# Altium project ai_uwb_smart_flashlight.PrjPcb (part 5 of 6)
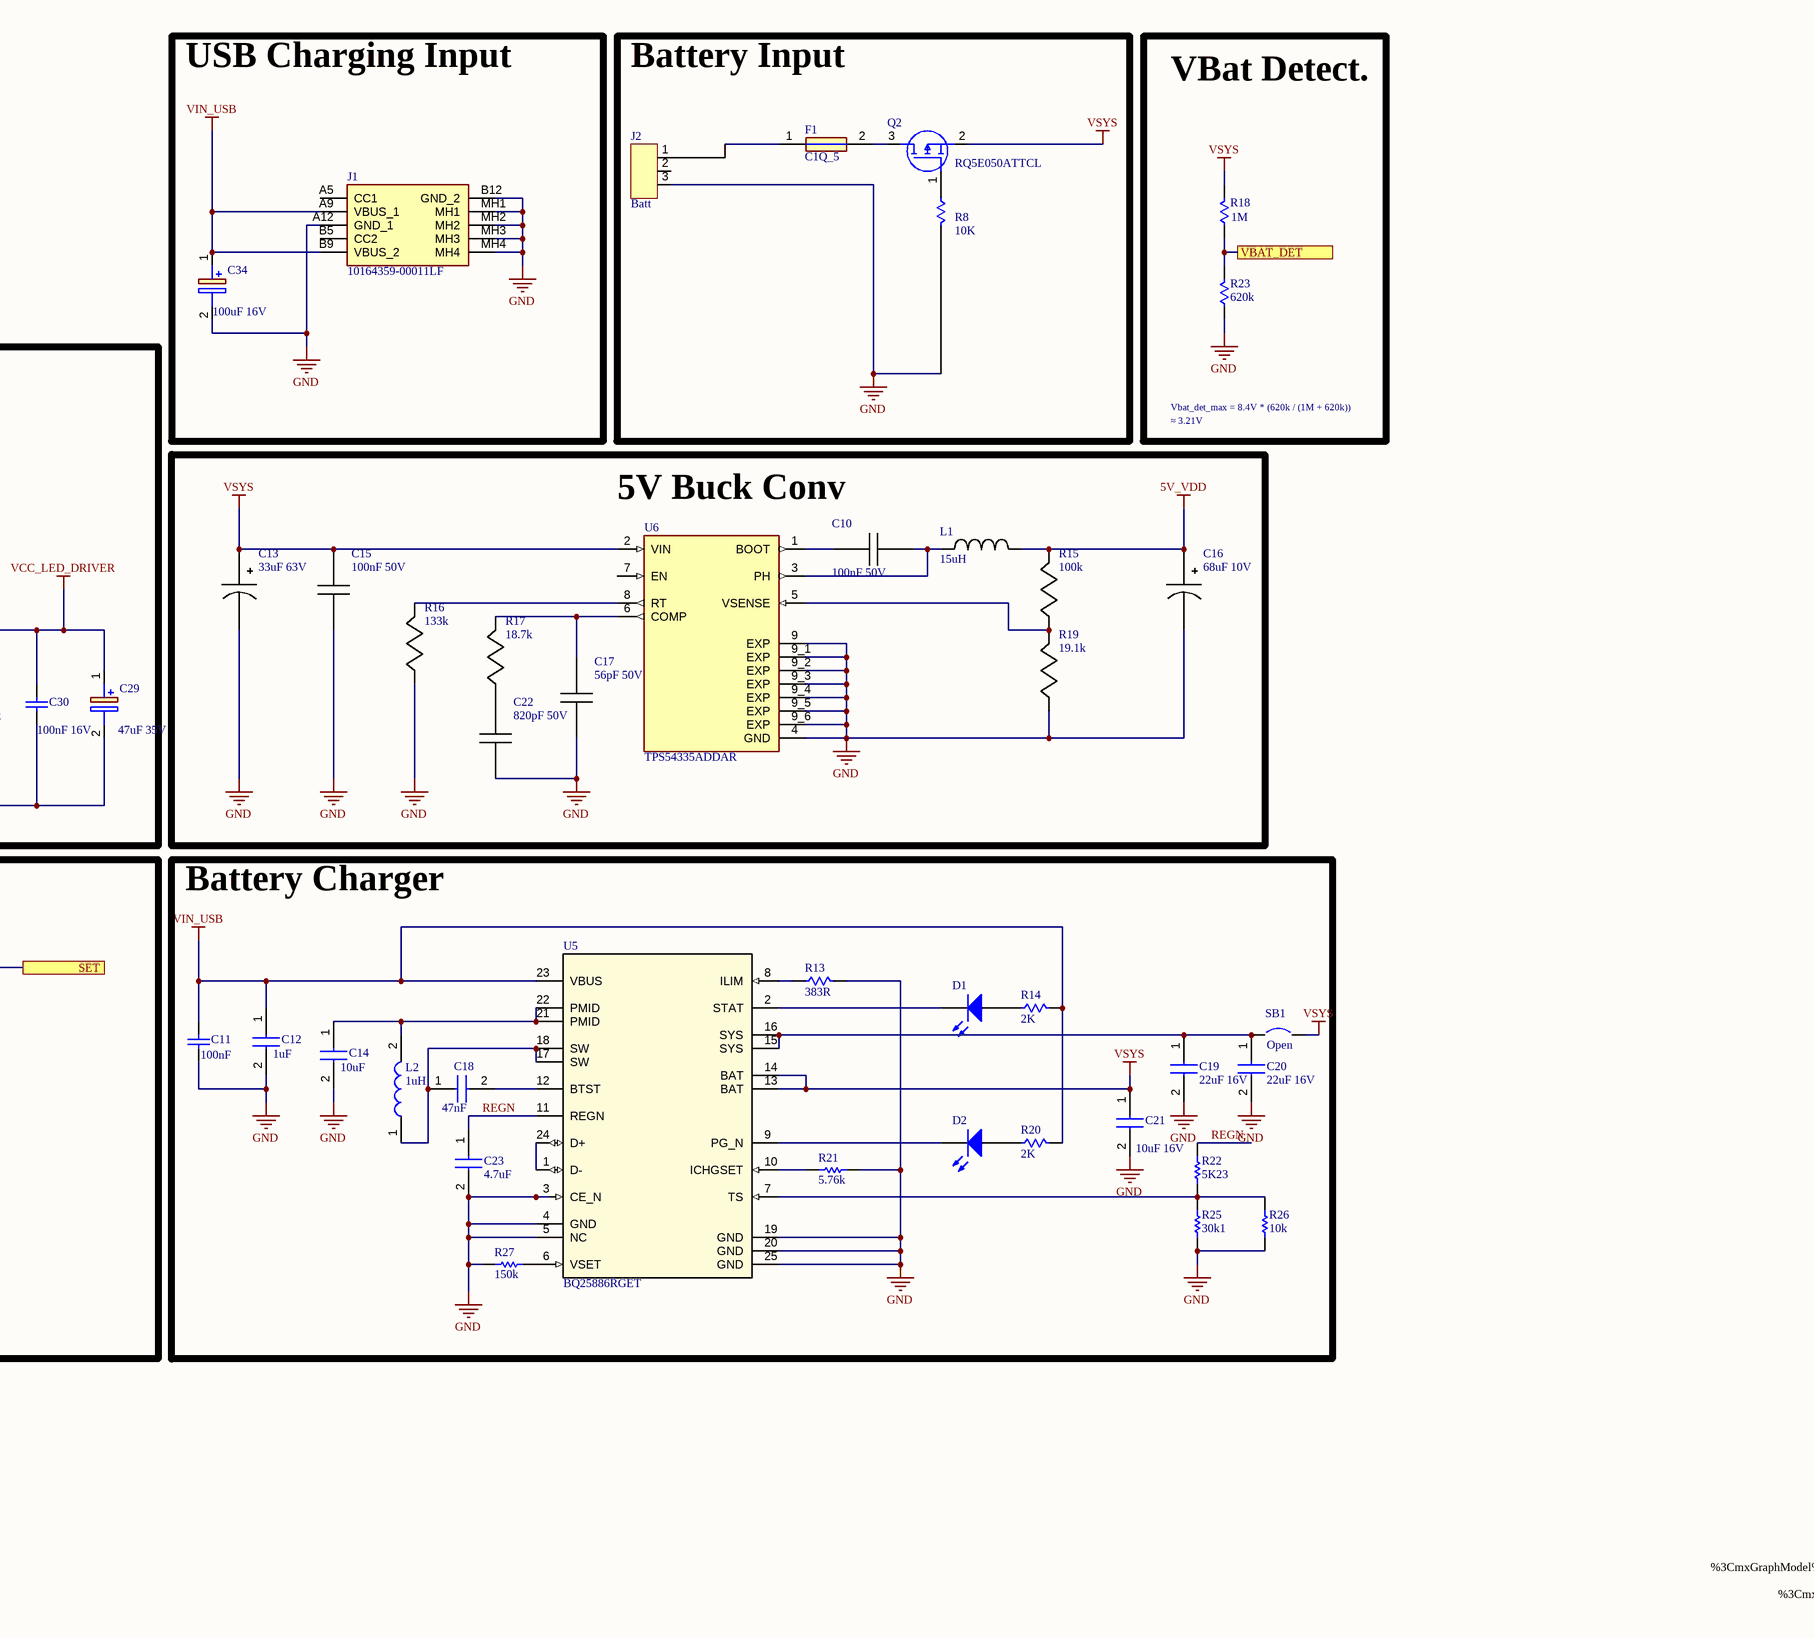
[diagram p7: Power supply.SchDoc, right]

## Sheet Power supply.SchDoc (continued)

### Notes on the sheet (continued)
ZUIVqCa8Jv7V0tcZ495%2Fp7y8vKKiorq6mtSt4F0Mijc1NTU0NFRUVGjbxaCpKzCuCMSDr6CGoQU5luogRLBwSV9XOmo5DOvgTSQOWdLSXD%2BWgBAWL5Y%2BDjo6I0uXBwcH79%2B73XoigI1ZVqQ%2FVo%2B%2FqqUcAB0wbgRzczBzDRPWoOIGIh%2B48M8%2BS5fL5cFB6lU68NqCMQI2W%2BH7gs1mq5Us4vl%2Fl3EEOQRBoN6GJtLU1FRTU1NaWlpSUvJp%2Bk4DtonC%2Bpdy%2B%2Byzz34dZpiYIVqAAZ1nWv3Pf%2F4zPJrIOq0B3xMDntrLXVBeXi6VSjVBHLzTgV5Gqy4mMjwEjXwx0RGR4SHpqUm4CojBQUfI5zKsY8CnUcjnTjc3fsHc%2BPJTZeRLp9dNPOhQUQ4OOkI%2BF1eod3fjgQgHjKf7iVzv3u0H0Q7%2BhKttW7DL9YK5cXXBgstnN4Ja0u9Scqz28iHxo%2B1%2FqaysPHnyJN7JaBJvbGysrKwsLi5eFaLpCjKaaujwE0y4w2jyzBjD7BiiBRjQeabVb968CY%2FmJLHSocMLppdDdu746MSJE5p0KGrzNDQ0lJeXh64N0ktlYIDJ3zu%2F%2FKAnhLFIdPxErjDFoG3dfkOsYzXTRGFicarRZAs6z7%2FYWJuy2ezojYIr52IunV4XH2M%2FYihZw6kfbW%2B02vw0lAOgg%2Bat5HI5KOUgykEcv3iRd1tbG6xRoAedJ5QzzbilYtHt3rrBwcFbPWWR62xHdfiqtvK%2F0UQvD0FlZeWpU6fUdjKaJNbW1mZn7zXI5aMl5RKJ5JkxhtkxRAswoENu9e3btwPrTCpPOhP5ri5a6FhdXa1JP0KTp6mp6eDB%2FXqpNowxeFEmUzi6fdoK7Mx8l7jILrQfP15ka2OqupwKP4tqfPKzjo21KbLNw%2BGwJ1sAo0G6AYrJFA6bzbazMYN5nInRRodngJ5ykI4OsggFthJAlgOU4ydyHRoaCg0NtbE2zdqTIZfLcQd5pCcNKIfDYb%2B%2B2kZG%2BN7qKUOgw2KxSJl%2Fx7uf7PzrWCgHeqe6uro3ItZMcCuhJeUCgYA8wDD7hmgBBnTIrX7z5k1kP9DgmjdKR31za58uSm%2BVLio76PlhrL22a5W1es%2Fz8w%2FTEIzmPzU1NW2JflOrU6tmjgwPycvLzsrKKsjPRSE7e19u7j5wbIkfkrUnA%2BUhReADGpa6AMgi0Z3FdGO8EPr4ZGYdG2tTIAltAY7%2BkvX4q421qbGRAr90YB1jYzZLKdSJ3ihgsxWF6LFiNEWNSjlo6srdjdfSXC%2BXy2HpJVLTHh5%2BFLbh9b6%2BPjyF6oyIcgR2ZmAgByzcFCltJNIY%2BqIq8DeavmK5t7bz5lRdU0VFued8jVZg6aut0JLykydPkgcYZt8QLcCAjppWH3Wpub7eB5pykGPFa53Jt3rK%2Bm6duXun83Zv3fdX9oHhvvy988cDd8LWh1D1FzqkV1efWLLIieYyR%2F2ppbm%2Br6%2BvpqYG136tq6utqanJzt6HW7KGYQbPhuIwmwCz5k4O03btcIFgbaVYz8JisbQaPyYn6yDKwdtk1Oad%2BAwCOzMdWEex8o7NluR43Oopu9VTBgorOk%2BEaX7VmlAOuFZF01UF%2BbmR4SFg4BuewJqaGnt7%2BxUBi9ADSWUwAqccqKS%2FyDJ%2FrztYgn6u5tOLiwt16HCoDvk84xPNb%2FoYczJLytWMqYZOYkBH%2FR0A%2B4EsFkuHT88xvidCPhcsxYHIWm397t7pvHphW6t0EW6bf%2BznFfK5%2Bo4%2BIO4AACAASURBVPqKQj3Orl2f0lQsJjoia09G1p4MJMmH3aw9GSCDGfF%2BVVhYOOIZqk6yAAWnOdMUy%2FufOvpG5edkzEV5UCQx1n54%2BFFMdAQsgkCeQTsIERw40jGlpaV9uevTrD0Z6alJqDQhn4srSuPpk411NKQcUmsnJsSg1iYpgOPpcOF%2BIldIRBoneINoFdeBdcB9%2FeWzb8LrAJaRtRLFaVVDyKwh5dCXrLm9HJjvUKUZVfqhP%2BPv4NfIiNWoA9FLpKmp6RXfCfLAhcQ5N2%2FeVNt7M4kT3wIM6Khvc7TUXDddEJ37mrlO5q3SRZfPvnn%2F3m31NcNSb%2FfW6dc5wBefp9J3KwRBSKXS0tJSiURSXFxcWlpaXl5Of0hzczNVFwPryZF9kcjwENyC842ebj%2BRKwIdAJTOpjXfXf3uu6vfXTx%2F6u%2BlH6mGC%2Bc7L5zv%2FPu5MwhodiY4AOhM5RrZzjJtrgyWFq6XFq4%2FWx0AtwmvBr5kBhyDDw8%2FUns3Jw%2FraEg5%2BGXill3QfArymYXnhAZBJhwhM0gv1DaLhonaso6itdns4jyFwsqtnjKFdzk2e1wlOmOknMSEmPTUpKSkhPj4%2BI%2F%2F9mF6ahIpILJHLQaCLpJA7jmkHCGfO2qXUldXV15eXlRUJFFu5eXldXV19EflZH%2BNmnr8IhbTnywpz87OxrpqJmrgFmBAh%2FIGIK3kiVxqXnbQE322UtYM%2BwFYR9Wvgg5vspc7n76nkEqlRcoNOhcULygooF%2BilbX3S7X1gYUqfiJXsDUCFnSAb8AqXWJCjI6g035WFXRg6PpbYhhYWK4pfg1qBeP6%2B1uj7e3tYVGMuxsPKAcWyKitvIZrzk2mcMY7gF4OaYBUrTNq7cjwkOHhRwX5ue5uPD%2BRq5%2FIFazbIVENNEhMdISfyBXQE1RPIAX34KZ6Fs1TtGIdsIxsbm4cvZEfvZHPYrONjcdRR2eMlAOLzLuot6GhIbAU5SdyTUyISUyI2fbBFi8vL2srE5AjAgYB5QQEBCRsU%2BTRvG1%2F0zk%2Fz%2FiEpiMiCKKkpAS6INQRFRcXHzt2TCKRkCyaksoJWx8y3i0Dmn%2BMDjI2Rk2KKAM6lLcB10qeGO3OD2PtR3xcU1aI4odbPWWt0kX0lsg1eb0%2FTU8h9Qtot6mp6fjx48XKTbWLKSkpKSwsLC4uRvlJkaamptB1apaaDw8%2FAjNrsEoFjK0NDz%2BqkhbDApbI8BAdQUedREcxshqzQ159FUAn4f1XoFlgXI8MD7GaaZKVlQUKPUjOMTz8SFXrGbUnvVzHfKqRmaligdi4BhfHaSnxDh%2FG2pOcbEzlGuGrroaGhrq7r0LKjBkz0E%2FAdoWFhShl8%2BbNaFlQQX6uXC4HBm1vP1dUJBkaGhoefoQyq0bmzLF%2F5%2B3N77y9ecECL%2FQrWLKODA%2FBl1VrzjpIv2p%2Fptv%2BTDenOdM4HPY4vZVjpxwAHS8vLzbFVlNTA6CDO6IfGhoK3xACT2NLcz1QTmFhIXoU0cuCHr%2FfX8TLnU8ze15bW1tUVJSfn19cXCyRSAoKCiQSSVFRUXFxcYlyy8%2FPp2GdsrLj49piaEk5o4NMMVgZLJkBHbqmR1rJE%2BNwQEaIwGYGXZ1Ufrt%2F7%2Fbls2%2FuTHAYyzscsMyTpoOoqKg4duxYSUkJkhUD7kD%2FUqrcJBIJjV2vwsJjqtXDQQd%2Bxft9uVyuOnXV0bha56krIZ9rMoWDQMfF1RVuKwwtnR3tILeQy%2BX46CKXy%2BkHGBrWUb1kvacgpXUZIWqVLkL66WamHBaLNZX7qymdoaGhrq4ukmUdoJzysmI8HUAHbxC4EWjEHRoawvPj8ZDgFXi2kOAV8GtoaCjYyiNRo4aso4APNru6wPvnu9fu3ulsqfBhjY9lZL1QjskUjlwu9%2FLyWrNyFviswP%2By2WwS6IhDlmx4PRieNGi9lub6qVwje3t7SBSHLAEZ59gnDfX%2BBOq3wMwv0kmfSWiXIIji4uK8vDyYOi9UbjCHXlJSUlpaely5FRUVoUNIkaampqhNG%2FRbYVQa9AOMWyuVAWpSJDCgM8ptmDCt5NgowcWmoFFqQ%2FFz360zrdJF6JXTIZK9by%2BpU0C7dXV18PFUUlJSXFyMWAc%2BpFD%2FUlZWduzYMXQUKVJbW%2FvnLX8iVQwHnYL8XAQcsIxFLperTl2NEXRwiY6LqyugAJwXDc%2Bv%2FWElWocFvuhJ1VbdNSDryAjRpdNr79%2B7DZOY4OccKIekwkJq7ZjoCJiWwr1twKWRGgQ0squkxUI%2B19bGtKuri0pvScjnAqrGREfAdCQ4L0PusdLT01RbTxPWUdg%2FVFhGRsrIb7LYbL0rI%2BuLclgsFoDO%2BjWCksN%2FLj3yLgrSY1Ek0IHGtLYyGZHo3OjpBrkmgI6l5QyYPAUPEnK5HE0vqjbj7yDl9XVBNBa8ysrK9u%2FfX1lZCV9ZOOhAL1Su3MrKyiorK0n9D9o9dOjAYp8xrQOlamfk1orxUk4xTBkymQGdUVofaSVrYqAsNkogI0QyQpS%2Fd7440JrqlVCbXnbQ8%2Fsr%2B0apDcXP9%2B%2FdlhEibc%2BIqrFubWBJSQnqC0iRioqKnJycEydOkEAHlJGPHz9eVlYGXrFKS0urqqpIh8MuQRD79%2BeQuhgYaDs72mGiqiA%2FF%2FQ%2FUIrq1JXOoBP9djishvBfvjw97W%2FpaX8D0GGxWO%2B8rZipiQx%2FMmtwo6cbFoiaTzXSEHTo9XVQO%2Bs9MtfJXEaIrl7YBs8FPHhqKUfI50Jr3%2BjphtbGvaiSKgag4%2BXlBaId8MgNogXZhXa5XA74QjoKdm%2F0dCMMglkqRDmff57u5eWlVjg6KusoFK7Z7F07XK6c23KtMzklwYGlb8vIeqQcG2tTAJ2AZQslR3LwcDj3K1XQKcjPLS8rQorwEJnKNTI2YuMyzv%2F3f%2F%2F13dn1rdLFsVEvqW18msQPY1%2BWEb4ywjd%2FrzsS%2B9Hkx3%2Ba62SemeIiI3xbpYuzM8Zx7VJOTlZtbS1VB5Kfnw9T5Ohzq7CwsKioqKSk5Pjx49AFVSo3GqFOWVnZjpS%2F4ldHExcHWpcd9IIL%2FzD2ZZqcaNKK0UGmGKMMnMyAzug3AGkl01tbAQ0b%2BMImzSPQvCHoJxkhununc%2FTaUOS4cm6LzrNXhYWFVIunmpqaCpTb8ePHYYoK9TLFxcXQv1RWVkqVW2VlZWlpqdp%2BqrGx8ciRIztSPkLXC3o5MPqCFoiQzxWHLIFhGMQ5Qj6XrKNzasU%2Fzn2c%2BOHbEWGvif3d3%2FiD95%2FWLUCh9qhYdvqvitDyAUkZOTQ0lMViebi9gNJtbcxAchMQEADTZCBJgnEaWCcrK4tmUMevxVCsU3bQs7MpqOfS51fObZERIm%2F36SwWiyTLgXq6u%2FFQa7c017u78W70dKtVcQVF7EULnYECoUHQvF5XV5fa8uEsOOhAChKVyeXyoaEhnVlHAXBstreHhbeHxQj06Hc5pH4pB%2BnoODrMFj%2B7BQcH74h3rKmpKS8rQgIwaKK%2Bvj6wUIpAB6auOjvaN4Z7991QaI%2F9cOVT4BWtWCc7ww2OunR6HQzbWrFOrWShjPC92LQSoRLpydfLbujawOLiYqoJ9JMnT%2Bbk5FRWVsLnFuqFioqKSktLKyoqpFJpVVXViRMnqqqqysrKqDyAVlVVHTlyZLGP46h19vG0gOtFF07FOowdZIpBaRIlM6Az%2Bs3AtZJpbCWDLOfnu9cGBwdvdh%2BVESKYRxj1jRLyufBprsmScqrqXutM1vx0eJX%2B%2BlH8sWPHysrK1AJKQ0PD4cOHy8vLy55uQDxAOZWVldC5nHi60UiGDiu3ZX7u%2BNlHjbc019fU1Hh5ee38KASFgOWLvLy87O3tSeqoiXFBKA%2BKRL25DKzv29qY%2Bnha4KAD5ApMoyppQHKdUSuJMqA5LBtrU4Gd2QSEV5bMLM3zaKnwkeR40FAOqqFWEWMjMk9An64h6OATWGhtXW5uNswYqtaEXq4jsDOzmG5sZqpYxabfhZAaUo44ZAkEXJ8apZDs5YBEB0AnLy%2BvsbFRIpGIxeLg4OA6yULA96lcIxDYuLvxgO%2Bj3w4HBxE3errDNryOpq5%2BuvPN%2F%2Fnv%2B3K5%2FJdffum7dUZG%2BNZJFqo2IFUKDNjQvSi7Jl%2BqMVu1BKUSmO%2BV9hjwG3%2F57EYZ4asVJ6mWqTYFVnFSgU55eXleXl51dTX64gKVweLi4srKyhMnTlRXV59UbidOnJBKpVSrzU%2BcOHH48OHkj58xl6W2PiDEAmNmd%2B90AiCqzYkM5zA6yFTDk8HTGdDR6BYgrWSq70ggFaRDMHD3GswjqH0xVBOVXw8ig4DOF198SgM6IIk5fvx4xdMN5Dc1NTV1dXU1NTXQuVQrN5jeUgtMzc3Nh5RbcNBi1cunSYFVP7hUAMVJOsKg3IB%2BJUXCNyhWlvp4WizwsDBXKnyw2GwkotMj69hYm6o6msCdToxrHNYn4%2B0JOsXIJi9NpLOjPTI8RByy5EZPN2Srq6sliFr8kKZGxU0%2FdaoOEkm3ACRwMLcFEqCW5nqQ8VRJi2FQz9qTQdXaQj6XnnXw69JXXEPKQeYG4LkCpWA0rzQ0NBQQEIAbF8VBRyKRJCUlpaWlhYWFIdApKZGwWKyamhoQGTo5zOrq6qqSlqAys7KyjI3YoOoEJx0eHobeqlMpXNGwBUAygRy%2Fw5it%2BQxUbNRLyN%2FW4OBgz6XPZYSvXuxZ4PVfvswTNG%2BonFsdP3788OHDJ06cAEUcmKiSSqUEQdTV1dUqt5qnGz3oHFRu%2BNnVxvP3ussIX%2FhwHRwcBMJTXdwKzw%2Bjg6zROGq4TAzoaNr2SCuZ6muyVrKgsymo79aZwcFBmEfQfC4JOAm9VJrWCct39cK2zBRntW8sfeLyVzwKCgqopq4aGxvz8%2FNLSkpAMlxVVVVdXV1TU0MQRENDQ319Pd7LnDx5kkoy1NzcfODAgczMz%2Bkro%2FZX9%2FmO9vb2YPEF%2Fjo7zXF1mYN%2FWMOByDAMZPNd4jJnjr29vf2ihYqWcXfjOTsp9l1dFIe7uszx9HBExXp6OM6YMUMvch2BnZmtjanVTJOJDPgoizfjiPAA36WJx0RHgN4xWtozqkRHtXB8ggwwCJ%2BORPOAk4R1NKQcIZ%2BLTD2lpyYBiwDJjbi1SkiIV7W3BKDD4%2FHEYnGYcnvrrbdAopOZ4lIlLS7Iz8UbAWSBuMAYdHTgfoF04VpnyuDg4O3v62SEb9lBL5pbif%2Bk7Ft8O5tW9t06c%2F%2Fe7SvnYmSEr%2BYzX%2BJAaxnhe%2Fnsxrt3OgfuXgPGIhkywE%2Bnc3zbB%2B8WFhZSgU5VVVV%2Bfn5FRQV8aEFHVFtbe0q5EQRRr9ygO6qsrKSSDFVVVR04cGBl4OhLN3YmOMoIX7zNZYQv6erQpBWLxWLsIGPD0aSLMqCj6S25efOmhYUFGGfD%2ByP06OMLfUFHB%2F2kSURGiACSNK3Qs%2FlGhEk6u4P485Y%2F0ajvgZkc6FlOnjwJshwAHUK51Sm32tpaqVRaU1NDJdHJy8vTpH8htVWVtJgkm0G7SOkVDqGX6MRER1y%2FfhUdqzbS1dUFsyrubjwIUDIMSOZTjahcFJHqPKl2W5rr5zqZb1jDow%2FiQGsEOn%2FcuAGJnSxnTsEPXLfKBv3E4bBVQUfza8eHedJREyPX0ZxyEOjAoieQMgLoJCYmhIaGgm0h0lVYW5m4OPHFYnFVVdVXX33V2NgIoINng0bg2Vi%2BaDVzxowZLk426Nmzs7V60Wom7PqLLGH6Cf3VauXBpvDZ6ECaKRi8YngcZBuohMwUF%2FxXfcVdHC2PHTtGo4wMgmeYK4eOqL6%2BHkDn1KlTDQ0NBEFA70TzuVVaWvr5559pUmfwqIquWq0cCxT%2FWSyWRCJ5tj9m9iZXCzCgo8X9kEgU0mYWi0U1gSUOtM7fO7%2FsoGdmirOqkJP%2B7crfO%2F9aZ7IWtXk2q4wQ6Txx7uJoWVBQQAUotbW1oK0MnUttbW19fT2ADnQu8C1VW1t7%2FPhxKmNfNTU18dveo28Btb%2BCjs6MGTPej3aLexrshdYzZswg%2BbqymmkyQ2X7c5RrZKjj8PCj9a%2BHjriPTv1k%2B9sbXdQG%2BFK3mmkCS42AhJBsw2qmSVtbGwmt1FZ4siW2NNcrP8oViwFpQv7e%2Bc%2BAjsJPuMIGcUqCA35US4UPpDs5KEz2jQV0hHyuAVlHK8pBoJOemhQTHQESHZJbDJJ9IHgM5s0ViMXitLQ0iUSiFnSEfO7RIwqTjDQbPHX%2BIsudCY51koX5e911EKgouyb3soNeOmDKXCfzD2NfLjvoVXbQa1P47PF7wqM2baBZGQ4GkUEXB%2F%2FcAtZpUG4EQZw8eZJmjfqRI0deWTpPw0vw8bRAba5KlvD0slispUuXPtsZM3uTrgUY0NHulox0W8A6NPqYGr5FpGwb1vA6dbWjc6unTPbURSWpWA13wzeIqdYpNDU1lZaWFhUVnTx5sra2tq6uDgcdxDqgEkhFS6WlpR7z7FQrQ3IzKeRz01OTwHkkzEyNDKXg1PPJcNuwQnY2J%2FOLtJS%2FJv5lU2DKeyEoJG1Z%2BZdNQWmfpqd9mv5J2ic7EhyqC7w7CBH4ugKDdTtTYpEyMikCoOMncpXL5V1dXenpaTCeQTXQeiW%2BnZXqVUzmFJ1Bp6XCB0ccUjxinS0OOnv3fIar8tDH8aVeBmEdbSkHgQ7CkcSEmLy8bLlcnrUnIyY6gsotBoDO1q1bw8LCdu%2FeDRId0vRoQX5ud%2FdVxQyrvX1YqGdMlA%2BE5a%2FMtbe39%2FLyGrFgOZkfMD3WzcXR8uuvd1H1IfX1iq6grKxsZHUC%2FrmFC3Xq6%2BvLy8upPream5vf%2FXOUvioMAwEzaaXdCGqg3AzoaNfw%2BATWqN6FtHqjwJ3nze6j2lVImfvS6bU6z1tBJV0cLXOyKW0GNjQ0wGKHmpoaoBwk0QHQqVJuVD1Uc3Nz3PtbVFsDN0wHbibxiSqSU88nA%2B2p1eC2s72lTtWj599LP%2Fqu67vvur679G074hinOdOGhoai3w4fGOgfFXRA5%2FTdd99hsVg8G0twZo4oBxQvkAqz6hXpKwVppILIBBceqNr3oz%2FpxICO5qIdccgSHHQmXq4D2jBUQlmqxgQdnfTUJHgYiook4C2kSloChoLUSvsAdGDVFVJGJi06K8jP7exoT3zv5eiNguqCBWiuZNcOl%2BW%2BlrDCnKpWv7%2F0AH8vGkypqakpKiqqqKgAKTL0Qgh06urqaLRzmpubR4Q97uo%2Bt3RoRmQ4h5m00mHAmvhDGNDRus3RBBbpy0yHt4V0CAh1tLWmc%2FXCtjrJAlJROuwuX%2BZJQyoNDQ0VFRVlZWWwooEgiKqqqvr6%2BpMnT1ZUVNDIipubmwmCUFsf3M2kXC4H1YfOjnbwdEiyjKwb6ORlurHY7KGhIfjs1hB0EhNikKQB2buDr%2FmhoSFkN1ntRY09EYbSluZ6iIBlPzA1BABEAgX6M04k6Ph4WowaVEFnIlkHtEe1pRwk0RGHLHF347W3n5PL5YsWOuMErNZmMYBOWFhYXl7eV199BRId9GjBjQPQqZUsPHsioOH4q3iIj1GIeZ4fiQ40SE4O5RdXc3NzbW1taWlpWVnZyZMn6%2BvrGxoaTp06VV9fX11dXVlZSaXLDD3blug36V8WDX9VmK9UbsykldbDp4EOYEBHl4ZHE1iqq3k1fFWosmVnzL189k3Nl1%2FBpJXO2jmkanz91Rc0rNPU1NTQ0CCVSmFtJ6w3r66upvkCg9LWvRZAOhHs4k4JQM8X%2FuIG78lTV1pKdNSAzqnVsm%2BOkkLHqdUwdQUSHSAJq5kmXl5ePBtL8C8No1pMdAQMVOMn1xkY6B8Y6IcmytqTERkeAn%2BRZwyQM6ltUtXECQMdMJFAmuEi7dZJFuCgg%2BuPg60j3FUWWsqkR91k%2BBBXbSVNUsCjuMkUDmgNwzo%2BsKOjqqU%2BPPwodI1H4vsLxGLx1q1bq6qqkB2dnQmOlRXFaWlp8KWEQOdwzmeSw9koFB7O3hju9xyCTgDtF1dzc3NjY%2BPJkycrKythERZY86IynIM6NKrPLU1uPSkPM2mly6hp0GNYD5hN%2Bxa4efPm9OkKE7R6d6E818k8f%2B98xTL1H1pHrde1zuSxeH4gvb1CPvcVXzfUL9BEmp5uNHnQTyXFEjiRtZXJVK6RyRTOVK4RrIXGQQdVBh%2F8xCFL9A46sqY%2FweQX%2FrejcQOADkwStTTXI1dQyJIvTKvBkDaurIODDmoWIZ8LEDY8%2FEh1WMWzkeKTGXSgtcFsz8BA%2F9DQELhTRbZ%2F0DydvliHxWJRmYcgtRu%2BS5LqIU0dFFGdt1LII%2BOCcjP9YNVVWFiYRCJRtaMzlWuEQOetTRu3vLMZC2%2F5%2B817DkFHyOcmbY9DHQhNBPohmgz4T1SfW%2FiN1iSOVloVFhaO2kUzGSZJCzCgo%2BONUGjIKjcdxOD0r5PSs4xzZ1PQ1Qvb7t7pUFu%2F29%2FXXjq9tlW6SHUtAH3ho%2F6aEP8u3juMPb5E6UIP7Pfb2ph5e1gofC%2Bw2VO5RjjoFOTnxkRHFOTnRoaHuLvxQCUCd%2Bqpr6kretBxd%2BMhXwdg%2BA5NNMDMGoKM8WMdHHSQrSDdKAcs%2BIkDrS%2B2rKUPpFVX0y0srl85QhP27%2F8EV0Zuaa7XQaIDoAPyM1DYamqsB0EO%2FMXng8bOOjDjoNY2BP17ASLGwMCAgICA2C1r4mL%2FgIedKbGqs0s46ISFhaWlpSE7OmAZuUpaAo9QdvY%2B2YX2Tz50DA4OFj%2B7LVro8HyCjqvzi%2FX19WPvfFAJR48cor%2FFGv4KtwxWWqntmZnEydkCDOjofl9WrVoFrKPDN%2BKo75XSn5ynjBBdPvvmtc7k3u6jvd1H%2F%2FndPjBFKFMuJhq1EB0yuDq%2FWHZcvb8q1GtoHvkwYauQz7WYbjyiKLMtxh5gpaXCB5wytrW1gatI5GaSxqknAp3zf%2F%2BmqfF0w4kS6b53T%2BbG4kG67922v5879%2FdzZ79pAGXkXTtcSDo6MkL894o0UuioDwCJDsxHgO8CNMpC78azsYTJC9Sq48Q60AjIyWhLcz1QjlwuhxXgqAKaRECic%2FMH2Z2B%2BzRBcvA1fHm527z5NJnvDNxvaGnVF%2Bikpya5u%2FFw4zRyuRyeDZKkZIysA%2FdLk0Yj5SnIz21ra2Oz2fsz5yFlYRTZ%2BVEIPejg9IIsI4OwysbaNDd3HxQOoCORSPLy8mCe67kFHSGfu%2FGN1zTvZ%2BhzEgTh7qZmySfpLo%2B6SzIPqPvIwRw54S3AgI7uTY5PYOnwmTjqeyXkc%2F1Flh%2FG2oNtnrKDnmUHPXcmOOjd%2FjqpJq%2BtCaCx%2B0ffp%2BC%2FHjt2DPoXDoe9euUs8LPd90Pr1QvbZITIyWHaiy%2FOROqcaHkRWnAEH%2Fpo6ip%2F73wUZtsqZEKqdnQUicrg4qiYAfxr3BzIBsrIAC7%2BiwWqy7UWuisMtSHxCalBaLRlx4N1cKv%2FcrkcX3IFcyU6KCP3dNXfun2Lil2%2Bv%2FFdYe6rOOi4ujpfu3yWKv%2FNH25ISw%2FpC3TQBNCNnm6YrPT2cmKxWDCNRboXY2Gd6ebGI8WSCtRkNy8vu62tbfdOVxnhe67mFTzICF8a0DlZtF5yOAcPB7N3I4kOnBpRVHBwcFhYWFVVFQIdPp%2F%2FfEp0hHyus6Pl7t10KoN4V0MTJwji3T%2B%2FpcldHjUPcu3CTFrpPmoa6EgGdMbU8GgCy2QKZ9T3ZOIzWFuZgBNEkykKV4gahhdemJqcnHzixAma7mPUnw4fPhwYGIDms3ftcJERImjrez%2F%2FKCNE22LsORz2qG3S0lzf19fX1dV1o6cbhS7lVldXix9ua2Pa1tYGP3V3X73R0339%2BlXYBVkIZKYCHbwotXFgGtWlduPBOiDOSUyIAfZCu6AWrbZ6VIkg0enqKL7Ze50KXLovnT6WE4yDjouLY8mxnOpaQm2oKC%2Fe8bdt%2BgId8IcFy8pioiOGhx8lJsQse8Wnq6tLVVIyFn9YuoGOyRQOOLGvlSw8uv%2BTggNZeKgvDacBneaKoP1fvZ339a8h98s3SKAjDlni7eU0lWuEpq5gkkssFr%2F8ssDO1gpZraS6xXa8GbPtZlD9KuRPs%2BPNEAqmU2fgTs6fXlk6%2F%2BjRo1TOHEbtgmCJ1p49e5wdZo79AuHhYSatxjReGu5gBnTG2vZoAmv8luHo9pYCZJhM4ZiZah3mz3fJyckpLi7WpDch5SEI4tChQ5mZX8B5YXZvW4x9Z1PQwN3uBw8eDNztlhGiiHW2qp%2FXSBMFXbI4ZMnBAzmFhYVV0hIUiookCkMmyhVJ4J4pMjwkJjoCMsCvVdKSyoriwsLCyoriKmkJmofSGXQmWK6DWmCMEQCdlQGujk5OlMFhTkq8Mw46xlOm8Gg3qxdf1BfoJCbEIA9ZuGOsEcopLCxUJUudWUcH0IGP%2BLy87M6O9lrJwr9sfTcp4S8obE%2F4S0HOGhrQQdNbeIQEOuj%2BAui0KzeYunKf9zL6lTIimCm0d1QEKpQRChW%2FCoWUJfAnKegI%2BdyPPko4dOiQbgLmqqqqPXv2rHstaOwXbmvzZD05mAcc65jBHD%2FhLcCAzlib%2FObNmwKBAIZzKseKY3%2FTtC0BKGcs5ps%2F%2BMu72dnZubm5NEbZSYjT3NxcUFCwZ8%2BevXv3BgYshDqDfTYnh2kyQgQa1qBtY25urDqGga4GyZr%2BwEB%2FWloamEvOP5qbfzT36OGcrKysw4dyYJf0Nzs7KzdnH2RLS0vL%2FOLTrD0ZSNtjLKDzW2QdAB3fRS8hbomKioqLi4uKikIpPB4PgY67G8%2FaygQHHR8fH2dn5%2BTkZPwQAB2kmg3KyP%2FsqaUSGkF6c817pOXlaKm8uxsP4hABZwtUUjTdWEdb0IH8NtamaGEUsMjWrVuTkpJA7vJVmh8V6MRGB%2BTvdVcNmSkuLc31aEEZerVh6gqceIMZZc1AZ8YT0OGbo6Keibxkp8jwkh6UVJ4pdkLwaNEChxzldvTo0VEXkKPuSCqVZmdnf%2F3116mplCM7BQAAIABJREFUO%2FRSZ2MjxUQ5TKeOdcBgjjdECzCgo4dWr66uhteAw2Hr11yybm8pdNBjoRyFTu48u%2BynW06OQqZC5W%2Bvubm5qqrqyJEje55uaak78ZoD63h7WEhyPFoqfPZnuikWXrFYs3lmeDZYbpaZ4pyZ4ow7fh8BHRaL9de4OVfO73yszTY4OAgqO%2BZTjZBlmjGCzriyDkAAzE%2BN%2BpdGowhvVXc3njjQGged0NBQHo%2Fn7OyMg0tKvDOiFlXQiYuL8%2FHxSU5ORmwEoINOBKDTc7X8x747VKxz6%2FatphPRWl1jYkIMWKlWZWIhnzvPlbd58%2BZ33t6csC2GvrlAnqcb6IxAFQ46SUlJuL4wDejc6Onu7GhXG4aHH6kFHeQYa%2BvWrWKxWCPQUQDHNHQjKCIUDDQhsEJRJU3FSJvfigDWyc7OPnr0aFlZGZWzGoIgiouLAXG%2BVm4rluvBkioyghwZGamH0YIpwhAtwICOflr9008%2FBdZR2yOP8VXX9nAOh43PownszGbzdAmixW4hK%2F1CVvoFr1wKYVXIstfWBK4PfXV96KvhG1avW7ty9arlK4N8SWGOcAacEdUcWAcpCxsbs1XVt5Uump84nsRtPStAh83etcOl97s0bTjn8b%2F%2F9Z8yQhS9kc9isQYG%2BrP2ZPgs9HYSzlJVRrazsVi8yLsgPxdVmD5CJWmAdJ1X4XV2tIMBulH%2FJibEjKq6gS7BX2TpMX82YpTAwMA45YZSeDzeu1H2KD8JdHg8HuTHwUgt6Fw5n%2FPP65eoQOf6d%2BcaKv4oDlmStSdjBB1eDV7i67tw1ODsNIfqzVIwXMgSn4XeXl5eoiUL1Ba17BUfUHAW8rl6AZ2wsDCgEBC64KBjbWViMoXD4bDNTDkpyYkgg0zDtvT0J4JJZAEStbmQz0WrrsD0jjagoyk04Kf7rcSdHSxXr3oFgnjVK%2BJXXxG%2F6rdmtX%2FouqCIsFVvRq55M3LNhteDV4UsVQ1jv8YnHReLJRAI9DNUMKUYogUY0NFPq9%2B8eXPp0qXQI9OIUnw8LTassdHZkLG%2FyFIcaD2q72LcKhq%2BJBKqN2F%2FORw2bjk6Ly%2B7RrnV1dUijRnoiWKiI1qa6%2BlBZ3%2Bmm26gs3rlLACdgYH%2BzZs3L%2FCce%2FF0ESnY8qzj4%2BNv9HRr3jNSsY7JFI6x0ehK1mpPBEvP1P5ESgSdJFIiza6trTXCml27diUrt8DAQJT40uxfP%2FptbUx5s6ain0ACxOPxoqKinJ2dId3a%2BkV8ohYkOglbA1atClm95g9qQ0jwii9SFJaRs%2FZkpKcmPdF7eLpQDkEwX%2FBSyCpx4Ar%2FwAA%2FUzOzX4Op6cwZUwWzpwtmT0%2BOd0Whvmxj4Ar%2FkFVivuAlVAiKgJkraFidQUccsiQyPGTk%2BUQsIpFIYOoq0N%2FF3Y2XtSfDaqYJm822szFbs3KW8xyFa%2Ffp5sYmUzhsNntHgmN1wYLojQI2m60KwZHhIX%2F964ccDhsKT0pKysvLg8JfeonP4bCrpMU0d5b5aYwtQNOpCuwUgmfYLl26pJ%2BhginFEC3AgI7eWh0p63A4asQVQj53Z4KDjFgCIX%2Fv%2FLlOvw4tmryrZQcVZnVkhKhVuigzxZnmEBx0YDxetmTmrh0uKIiDrK2tTMY7mJkqvm6BdXB7x2ALDmzS4MqnG8O9a4pfy897Kz%2FvrfIjfugCBwb6wd7gpk2btJLooKmrqVzF1BWAzsJFPuD4E%2F%2Fr4uqiLehQzWGBZ2xUea0iLc31c53MwY4Azd%2F8vfN1Bh1nZ%2Be4uDhgHR8fH0QzOOgI%2BdyXZpujn2CSiyQEsrW1xi8NQGeteA46ysfHJyoqCkESpCfHuz4DOmy2JMfjiYUk5bMtI0Rdso%2FvDNzvuSprPVWJSqOJXLt89sa1i3cG7n%2F39w9IRXl7WOgFdNCVBgcHb926FdxzkvSFWSzWcl%2FLK%2BdibvWUna1Z4zxnGgyQ8TH2vd1H7%2F3849UL2xZ4WKguz8SXl4vF4ry8PPCNJRaL57o8j76uUGtPQKTsoBfoibdKF2emuJDOiBaNMuvJ9TZMGqggBnT02fBIWUe1O9sUbgeI03Mp4%2FLZN2TEkvy980nvFc1udsZcGSG6dHrttc7kzqYgGSHaFD6bKr8q6LRU%2BIAZG%2FAa0SpdpC1mUZ2LJl1gZ4ZYB0CnID%2FX2sokNDQUHHYiCzEwZ%2BQvsjyUHb1TuZUcWI5KHhjoF9iZJb738qepsbqADos1TqCDWAeX4Y0RdDS0L6wz6Kidh%2BLxeDSg4%2BPjExcXd%2BDAgbi4OAQcJNDxE7n6eFrgoAMKPSRNoOR4V5hveiLRoQadOwP3ZZcuo9PRRNBM2cSAjlgsTkpKAg%2BdaHZpNs8MzAne%2B%2FnHBw8e3OopW6OUI7JYrF07XMC%2BeW%2F30ch1tqomFXDQAcRpb29vbGwUi8XPs8FA9PqPXyQ7w01G%2BF46vU7Zqa6UEb54pwryPxaLtWrVKn0OEkxZhmgBBnT03Orbt2%2BHLzmSsk7%2B3nkyYgl4sLr384%2BXTr%2FWKvXR%2FB2GJUtQ174fWmWEKDtjLtXhakHnWmcyHN5z6XN6TqIqVod0xDoOL88C%2F%2BRCPnfD68Fyufzzz9PBUtzAQH9Lc73vEhdnh2nvxoQD6ESud0OqygMD%2FZkpzjJCpO3U1eDgYEuFT4RydEESnQXeL1888y4pODtqPXUFrQEzg5McdKytTGxsfp26UquMPOvFqajBBXZmL1pyEVsEBgbCVBeujGxrqxAK4o8ECXRCQ0OjlBua7eLxeOHrXrKaaeLp4ZiSnKgYSH6DoLNVuTU2Nubl5SHQgTmO%2BBj7a53J937%2B8cq5LXZKdXsWi7XAw%2BLy2Y09lz5vqVjEVno%2BwRsNNJ1xy8hbt24NCwsDY8oM6JDaSr%2B7MsK3s2nl0071jIzwzc5wg1Mg%2F%2BSMao6eB0gDFceAjp4bHlfWwefjAXSQ76pLp1%2BTEUs0fG%2FnOpmDLwio6907HTJCRCMQUgs6PZc%2Bh8MnEnRgGbCZqcLhs1wuHxjoR4aP09LS5HL5kHKTy%2BVdXV0zZsxYu3YtgI4Nj4dab2CgP3%2FvfB1AB5SRt8XY4zo63h4WpAmODqWZZh2mroR87m8CdDgcttWLL%2BLgAivMUQqPxzOeMgWBiw7KyPAk29laoTJ37doFoINrApmaKuyR2Nvbx8fHK74HNAAdkCeBhlBgYCDaDQwMBGKbYIlOWFhYY2Nje3s7aQW4%2BTSjF8yNozcK9mfOW%2B5ryWazLaYbw8TxC%2BbGCzws2Cq2vKHRkETnr4nb0lI%2BwsOq4IXPrWVkDftGnbMpO1Xfy2c3Yp2qb%2F5ed%2FRSM6o5eh4aDVocAzr6b%2F5Lly4h3%2BZIYTM2SiAjllw%2B%2B8atnuNXL3wgI5aUHfTQ%2FC0FBZ2rF7bd6jl%2B6fRaepGMWtDpbAoCh1kwzI%2Bq0ax53UbNKbAz49lYIkv%2Fcrk8a09G9Nvhcrn8%2Fa3RVjNNDh%2FKkcvlq19dkpryJwQ65lONQIvo7t3%2BRV4Wu3a4EFVJWk1d%2Fftf%2FwlKqfjUlSrogD%2BK5wd04uLiQFMH19GhAR2kZ4MrI5Ps6MAzgINOaGgoWOtBh%2FN4PFubFwR2Zn4i19RPtgvszFLiHUjQiXR00NRVaGgo1BYXEcHCMZAVTQDo%2BIlcX%2FvDSjNTDugLi8ViJHR5ScA3M%2BWkpyYJ7MzMpxnB6MhisZCQz8ba1HyakckUznRzY7VvCgKdgv3xe3el46HkwCpx8Hy5XE51rNoCmUQNWwAUdK51Jt%2FqKbt0ep2M8AXvOozVHP0PioYukQGdcbkDyDUEh8OGGYG5TuYg1AFNnVapj1ao4S%2ByrJMsQKMCjThHyOeqgs57b8%2F9R%2FNKFN6PdnN341EFqm6CKr9qumoJoKOTnb1vub8POK0Ej07Dw4%2FAo%2Bfw8CN%2FkWXRoY1Zu9%2FP2v2%2Bq4sNGjP6%2Bvrg619HZeRndXTMzY2dHKalKBTDFZrdu3a4ODlMY7HZv1fQcXfj4RIdMP2XnJzs7OyMIwgCncjwkD9u3IAbDFSrjAygQ1omhoMOTHjhK9J5PJ5gtsIRgZ%2FIFWwDwowkeqohAsrIOOjweDwwV4gUoqOiokDZeUTSMwGgg1gkODj4rbfeqqqqSktLA2VkVxd7Ly8v5KoCTDmoPv80Kahw3Hoyim%2BLXSKXy1ksFjXrTBMKXxYKBZSnEFgJ7ecIX%2BJRZvgtWNMZj8orO9WFqKlBnIOs5jCqOeMyNBqoUAZ0xqvhY2JiYKiGdR%2FwoooDX4yNEmxYY6PDezvXyXzDGl5slEAc%2BMyCF9WiSKDT1tY2NDQ0PPxIk4AM66kWC0SCC2YgrlosafwDl%2BAtzfUhwSs4HPZyf5%2FOjnY%2FkWIBTmdHO3iwcnfj4cvLawq9BXZmEAYG%2BlPiHVoqfHTQ0aku8Pb3teRw2KCjk5WVtVm5%2FSVuC5iYey%2F2HUipqanRank5tM%2Fkn7pqaa7HQQdMBaIJJhQxnjLljxs3gD8NAB1HhzmULiOcnITCl3AXEEI%2BV7Eo3ebXqSukjIzjlA6gExcXl5ycHBoairMO7IJy9ISBzrYYe%2BR3s6qqKikpSSwWbwzzwEFH9a0ZNQWBjrPDNAiR62zR6AugA6OvetYZ3QWEQOkCQgNvEs8f8TztVF%2BCThWmGlmM1ZzxGhUNVi4DOuPV9Ddv3pw3bx6wDm6%2Bb9SOb%2BwZVEGnSlqiKndRm0JzdrX5VRPTU5OoiAHpJptPNZpubkwKc4RTkaCFZDBw7Do6fX19Lc31gDt9fX137ypWm6NdiGhuMBC10niAztWLGf%2FsqaUJTSeiNF91BaCz42%2Fb8vMPSUrL1IaDubv4s21x0HFxcey%2BdBoxBCnS23ud5L1cyOeaTOHMmDkTkRM%2B04QS%2Fxim8LiklUQHHUsVQXUbv1VXhw%2FltLefq5UsQFNXoCwsFou%2FSvMLX%2B%2BHJDrowdA8UpCf29XVFfrsFhsTuS3uzW1xb6anJo1o8QvszKhZZ5rCvQONhwfBTIW8R0Dj9fP3bG9Q8xuBO7Q6c%2BbMeA0MTLmGaAEGdMax1c%2BcOQPKOiwWC2l6av7i6ZxTFXR0GMJ1PjsCnfTUJNWQ%2Bsn2d97ebG%2BvUBBGG2inxj%2FddqRs373rr0lJCUlJCTExb%2Ff19c3mmTnNmfbee29rq6Oj8DWhVALt6%2BszNmI7Ory8%2FnXFkLLpT2Ex0REx0RF%2F3LghNDQU4qS%2FYOlHbTsAZ8RER7z9VjhemmqBNIWolqy5xyhtQUdaepDee7mLiyMOOq6uzr3fX0UMQYrcun2rtqaKJNEhgQ7MjsEcE2KU5HjXSQI6fiJXuN3Ikwa6p%2Bi%2BIAODubn7lE49F0S%2FHbX13S14OLzn1W1bA8cCOuCwnSQWBSV9SAQhKy3rMKSihxbgcBiHVuM4Ghq2aAZ0xrf9kWUdKiuCqFfVY4QKdPxFlhoGvDJmphxjY7aGYcQ%2BLAIdWEvVpW4LXBGATmFrY%2FrO25vV5erq6%2BsbGhp6oqPDYumgowPXK%2BRz797tn8o16u6%2BShpRhocfUc3rUcmlhHzujZ5uVI7q4ShFLperzuKhC1eNAOh8dz7nnze%2BI7EF2r12%2BWxDxR%2B1BZ2GllZUgtqI27z5OOi4zZuvNhtKbGhppQeduLi40NBQtEgKWEdz0On9%2Fuo3ZxoQIdFE%2FtnzLTCZ5hKdyPAQNAN7o6fbT%2BRaJS1GKeiWIdDJzn4COgey0g9l7z6Uvfvgk%2FBl2ZH14euXjgV0VB8DKqahSlctgUnRtgWQbUBGNWd8R0QDlc6Azrg3fHZ2NoguVK0Iavs2apifCnRGZO8kxU%2B0e%2F7U6xcaN15o3NheGdiWP%2B%2BNZdOD3MwguNtwRC%2Bb%2BLrOfOUVHwj%2BvpZqA0tp4R5AB7SPFZIbFRv%2FI46rcL0lIZ9rbMxWmy00NPQJ6LDZ22LsL%2F99h7YSHbjA2CgBfBbf6OmGBTLI09ZY7PuhlahoiY2Qz8ULLMjPRaOmJvcOQEdanHj0SJ7aOSZJadmh%2FbsLsl%2FVFnR27Uq50X2cJvAFAhx0pltYnDm5%2BmLLWqrwxnpHHHRamutJEh1n5UYCFLCM%2FPnn6UlJCVO5Rgs9LVQfpNDQFYcLCnOyvvg4KW7GzJko2NlaQXjxRUuUOBLZ91Vazr4vDxcU%2FvGNpaTSzM2N1VpGBtvcMdERMDHU0lwvl8s7O9rBFYlcLgc%2FYqqgc65mKVHq%2FySU%2BNeXLGup8Bmjjo7aB4OKaVD6REqI1dbw95RoPvXJcrmlS5eO%2B3jAnMAQLcCAzkS0emRkJLAOyYog6izAiSNI0UFLF7l1RHmEfC5KRPJ2mAhAeeBYLy8vZITGaqZJW1sbTF1Rgc6Zhk8ePXr0L%2BX2oHzbnTgz1XD%2F2FuQ4dGjR1c6sxEh4REWm21sxE5MTOjuvjrLWrGe3N7e3t%2FXsqXCJ%2Ferj96L%2BaN4VYB4VcCyZcuWL1%2B2IsAfhWXKDX5N%2FCD6wN6Elgofbw8LBDre7tN1tqMjI0Qk0EHNReISPF3DOL2Ojm6gg9sXVqs7nBzvqi3orF45C79TpHhLhQ%2BLzcZBh8VmgzVtUk60C2YYEcYB6ESErf0sfceu3V%2BrDZ%2BmfVyQ%2FeriRd5paWkJCfHGRmQxockUDk0Q2D3xdW8xXeFDSsMA6nFQTwQugDWgIw92LNEMY2dHu1wuJ3k7RxIddPkoUl2gcCmqX4kOPHuIaUg6yAI7M3AdquEjymSjbwFkG3D69OkTMRgw5zBECzCgMxGtTmVFEN5AZENvePhRZHgI2gVZOhpLCvJzkXR9ePhRTHSEuxsPJlCgHJJAHhI1AZ3Oczn%2F%2Fd%2F%2FDcKS%2F5Qm3P3A7OdU54dF7wwe3nAvcxGkPCx6BzL8%2B9%2F%2FvnKxGHX0eMRpzjSTKZzExISuri4AHS9Pp%2BiN%2FKbywIKDWVvf3YJUOGkiyR99eDD7y%2FbaV3DQEQdat0oX6SDRkeR4SHI83gi1HR5%2BZGtjChIdIZ%2B7KXw2BL%2FFM5GqkNoILodDs%2FiknAs9LKLCZ0NABVrNNNEWdBT%2B1Z91pHDgwIHApxuSjoBcBMZmtciLczMoI08M6Oz7Ko3ee%2FnaNf5eXl57vv5sxBa2hqFKWkI1UPmJXDUsBFazk0AnJjoCXhmkwQaUg86I8mdn77vR0x0bHaAaNka8snnz5vEAHTC2qVYHGVxqI0vWVO3DpI%2FaAvChAq8z47ZzIsZCA52DAZ0Janjc5ScudgblAPDnDLaDwcxM1p6MKmlJ1p4MNJIB6GTtyUhMiIE80C8PDz%2BC93l4%2BJFcLk9PTQKjw9Bf6wY6D%2FatBNB5WPTOvcxFwD2jgg4slcKnrmKiFsoIEQKdpKQkiUSSlpa2e%2FduiUSydevW9vZ2sEdy%2BfJliCDQ2Z%2Fp9v57bwwNDQ0M9Lu78RZ42AmFQm9vzyWLvQMDfFaFLKYKSxZ7L%2FLx9vT0FAqFM5RbW1tboXLr6upKSkoYEYO1ShcBorVU%2BKQkOED45pvKqzd6z39T80nKh7OebjyeDQpP0xT%2FPdznnf%2Bm5ttvO6%2Fe6K0u8O4gRBCKcjx2JDiw2GwdQEfI55JAJy4uDgzG4PaFQdNFyOfCOA3ih%2FTUpOHhR34iV3gqYHYmMjxEc9B58431aHm5bhKdQ0fzkRKPauT2TwMhq8R%2BSxcmJsSMOgKNRwYELiDRQZ8NADokyhHyuSh%2FerrCijf9Nh4VxlkHnx5lQEdfrY0%2BXaqrqydoJGBOY4gWYEBn4lr9zJkz8OnA4bCRxWTQD4D3NjI8xE%2FkChADvSpoSsKvADrAPXAUuP7GQaezox0MBsrl8rGAzsBHNsA3dz8wu5e56O4HZppIdEYFnbS0tKqqKrFYLJFI3nrrre3bt0skkrt3727dunX79u3wEwIdGSHaFvfm8PCjlub68%2BfPtbW1nT9%2FrrOjXYew5%2BvP0CgVHx9vMoWDQAeXSPV%2B33r7p4EfbvV%2BkZmJxCdUET8%2F3x9u9d7%2BaeDOwH1EOSiiCjrubjw%2FkSsE1E27u5HNuM11MndymIVOCou0cVM0PB5vgceLUAIYXUSgAzcd%2FoL2CbQeh8MeVaLj7T49NDQ0fEMIGAzUDXS%2B%2FOrz3u9P0wS3efMnA%2BiALjkSnWbtyUDfDAX5uQX5uXBfEOhwOGwqCxEgEsA%2FXdDN1VcEHGmhyWghn8uAjl7a1mQKBzrkTz%2F9dOKGAeZMhmgBBnQmtNVVLSbjoANvL9jla2muT0yIwZftAOgkJsTAelSQlkOXDQcODz%2FSF%2Bjc%2FcCMFDQBndI8T4GdWeon22%2F0dM9z5Y0IqKI3LWyp8MElOmBpDWFNVVVVampqWFiYRCIB50EIdLbF2IeHvz48%2FAik9%2FgUkrbdnLsbr6W5HiwTfvy3D1ksltOcaTjiQLz3%2BydLkzJ3f41QgyqyzH85ElogvkER0MtGU1dAJABbMO0o5HM7O9oRpOJXhNsXRn4xcRPDYHZPyOeqgg7S3YFpTXh%2BRgUdGSE68vX8yMj1gSsC1q1dGRm5XjfQUeteA29nFps9GUAHvhAQ%2B%2BKTwpBI0tExLOiQbJ2rAR3BDKFAYXKaMghmCvnTKH%2BlOfD3%2BxNaZsUoIE%2FoEGigkzGgM9ENT1qEhYMOqBIDykCvpAo6qHeGvnhSgQ5YrImPjwcPnaCMvHrlLAXoHNBGR2ffMzo6NMOM2r47Mjwka08G%2FJSemgQraKqkxTHREaCjo1hkwWbjA7DeQcfWxmxEbnfwQA6oWAGzwlwkSOzgvqvV7cBBBzxGgQlghFw0oAMCP0Q5aOrKyWFa9Ea%2Bahix9gvXnr93fkx0ROCKgICAgNDQUBabHbHOFs%2BPcsoIUfRGvreHheqqq98K6IAaMrJ1qboLD88kkeiMAjqC6QrDx%2FZzKFlHyFdaRqb2EfH7pRm1%2FYOQz0XLrObNmzfRAwBzPkO0AOs%2Bs014C6xatQpEpmamHFUdHWCXrD0ZWXsyYEkIvK5IogNi9pjoCDTPBXqpSLknKysLHaibjg5JnKPh1BWLrZDwpyQndndfdXh5FoCOt4fFR3HOb4YF%2Bi7xcJ%2Fv6D7f0f7llx0d53i4O6IwZ87L8JP7fMeggMUb1r6SkuBga2MWGhqqVuZB1X9BOgn%2BbvR0A1WAUCc9NUkxgGkAOuBZCSzWgucmAI7k5GQfHx9coiN7qqCDJDrH8zyMjdhZWVk46ACbwn0E6hoVdA4cOBAaGhqo3DQEHZxyhHwu6OjA86b270JPiw1rFP43RqoUviHk1VcVXsFVc87mmW1Yw9uwhvdqwIvw628adOBRUTUrhXugI4GOj6eFav7ZPDN7e%2FtxnboaDXRmKEHHUcg3V%2F9eMKDzLMnBxB88w729vRPe%2FTMnNEALMKBjgEbv7e1dunQpvGk8G0ukPSqXy2G9DBLb4DbrgHvgMxRmPdCBkE0covD%2FBxs6cIJBZ%2BaMKbgyspeXF6gDk%2F6q2tEhZYDdzZs3jxF0Bgb6b%2FR0Q0NpBTo%2Byi0wUDHqHzhwACz8AnDExcUFBgaSQAfkIgh0yg8qZvFyc%2FfV1dXaWJuCRCcxISYyPAQqA7NpqqAzlWuEO1JQq4w8bRoXVFNh6gpmOUHjxE%2FkCjrpVdKSxIQYccgStGpP7SgIzn3A6gGsQooMD1n%2FuhrQQVOHoDICFUCFw%2FLy35BEB1pDVaq3M8EBNRQJdNS6IK2SFg8NDRkSdPjc2bbT%2BHbU81b8abNtmXmrJ%2B2DFpOzWKzW1lYD9P7MKQ3RAgzoGKLV79%2Fv7e0VCATAOna2VsA3SDXV3Y0HKajPRdJ1SEFSd1I23ezowPLy%2F1Zu%2F1EZ3%2F8XM9UwKHkbMvzrX%2F%2B63FGoOkLICJGqwcCn3EX%2BT1p3AwxHzqTcpwed6eYKkyocDttkCgctS8ElOgA6Qj4XJgFh6koTiQ4490bussHOLyDOiMfsqKgotaCDcKf8oOfIkpmC%2FNyamhoOh%2F3%2B1mj86kBPHJ%2B1RDeaZHaP5EIBhDqmZmZwsYiWoPDEhBhSS4IyMv0a7Lq62pqamqbGuoGBfnicZBfaa1Q2gqiFcpoa6yA%2FgCPU%2FLkFHbiJhgUd9PAwEfoWwL1ZHTt2zDBdP3NWQ7QAAzqGaHXlOVtbWwF09O4JC7eMLLAzO3%2F%2BXHb2PhtrUyqDgbKmP7a31Z5razrX1tT05cbaP3KPv26CQkmoSUmoSeNn6yDD6Zb6szUbRgUdsGSI1hmRIqT%2BCF%2BRRMqJ4I90CLKn7O1hsXrlLCeHaSw2GyQTegEdHo8XGBjo4%2BPj7OwMM1akXRrQkRGisqeg09RYb2zEBlMrBfm5IM4B0AEZTH7Oug9j7ec6PZl3UAUdqACujIxAB%2FBXHLIkMjwEpi%2Fd3XiwRBz%2BItsEqq2Hp%2BByHUgH96vo%2BWSxWGolOqgQAB0nh2m7drjs2uGi%2BnhA%2BiRRRkbVVq2nthIdBnRQY07yiMBOoTYHj3RiYqLB%2Bn3mxIZoAQZ0DNHqT8957NgxePHwBedj7y%2BMjZ7xsdDZ0Z6VlcXhsHfvdCk76KlJ8BdZompQ%2BWdQ67QBTV0J%2BVw0eKOi9BhRLMVisyU5HmisSnlqvUZfoIN0YtRGNASdluZ6gZ1Z2IbX5XJ5cNBidzcesA5a6fP%2F%2Fu%2B%2FZISoTrLAx9MiMSFGFXSSk5N5PJ6Pjw%2BqhqmZmaeHIzLmq5dWHZV1NAEdeJhn25rFRglIATHTZFh1hVoMPTwowoAOapzfWQQtJl%2B1atXTDpj5%2F7y0AAM6Br7TOOsgB0xj7GJA2w65m%2BjsaD96JNfYiK0bTlnNNNE82NqYpqcm%2FceD72HkaJUuys6Yq%2B3lVEmLweIzUgHp7GhH5muhNBaLBeuAfrh%2B%2FOeBW13nP5ARIicHhWlmYAhkjqhKWgIa31DmqMrIP%2Fb3a2JHZ5n%2F8h%2F7%2B8GODhomUQRJdOAS3N14K4NWQPvDvGTel4t7v%2F3o5zvN9wauQ%2BUzU5xBLsLnz%2Fb0mO%2FtvUBt8PSYb2VluWZ1EKwmA8kZrJwf41%2Fwq4oXcv36VeRstbv7Kqh14zo66M4Cz4F3AoRE6FdQp51ubiyYjZwLAAAgAElEQVSwMxOHLCFNXOLZxi8OyhmkuskI0bmmLc1nqyDICNGooIMytzX%2FRUaIGInO%2BN0yPZaMLyY3cI%2FPnN4QLcCAjiFa%2Fdlz7tu3D753TaZw9GXWHf9AB0oQ2JnpzDpa9TjS42n%2FHv4BDfkyQpS%2Fd77mJQCUDAz0I3tCMMWDoEfI5yrm2tns%2FZlu%2Fzi9Ftry54FbMkK0euUsDoft7sarkpZACXBUZ0c7KhCBDniHwP9evtx0%2B6eBq5dOp%2B1IROITqoif7%2BKrl07f%2FOHGnYH7%2BMVCnAQ6YOIW2h9wFtSW8crXSRYA6GR9lUbjvbz78tkVAX446MACLnzGihSPi%2F2DVBI1asjb%2B8br64IDAgJWBq1AJUAKJMZERwwM9FOBDpjay87el5u7D%2BL436ysrIMHcsCw0MSDDlAOSQVeyOfKCNE3LR%2BdapNB0AR0UGYGdDR%2FqQ2bEwxxsVispUuXPtv1MnvPSwswoDMp7vSnn36KWEdfnQJiHTAlXJCfe%2FRIblZWVna2mnEIjUnIAo1qNUb8fqNsNJF%2FD%2F%2Fw7%2BEfrpzbcudm6z%2B%2Fy4KBXxxorVqg2hSY2YGfQJW4SlqC2xMCaACJTmdT0E%2F9V%2B%2Ffv%2F%2FD9eMjE0DeHhbGxmy1xUIiroysOvU23cLihRfMX3jBXCH7ehqmTDF6iT8VgpHRr%2BmQc7qFRVLc%2FMwUZ1KIjVKYLUEGA%2BHswJogVKiTLLjYFNR%2FW3b%2F%2Fv3%2BH2WAgwA6%2B%2FOyb%2FXdQdYISZHe3usrg4NIoAOGIqkunFI3ixCREG1nggM8NsiRJFqlMmJOGswZqAWd9NQkpeSspKhIUlQkgTj%2Bt7Cw8PjxIkjR76Qb1VWjdCrKeQI6zUn1Z9ohUIGOsZFC%2FQtWXaHM3zS9jyQ6%2BpLFojqTIrjWnRqDgc8unyYd%2B5zv4iZzJkVfz1TCEC3AgI4hWl3dOXHjOvrqm2DQio%2BPx90mgDuF9nb17hRAT1ZtBVqa6%2FFy1Ma7r14Y%2Fl%2Ff%2FXTz6M8Dt%2BAq%2F3F6LWn8UFs4SsTtBZPWTKE8Qj7XZArHyUFh3bizKQhOIcnxAEM%2BeDZSHEBnNs%2FM1sZUw4DL2FQPgY9FqkU3JNAR8rkw6NramCbG2ncQootNQVfORQNtbFijMN9sMoVzOP8YCW5IuyGrxFqBDolmaHZhnhG30Kgh6HR2tMNKwFnWli9azUSrAlFkxowZAv6LMG03kRIdGsoB0DlVE1daXQ%2BB9KCamXJACGQ%2B1YjDYQPooMytRCwCHeRZnfS86WuXAR3dWhI6QBaLNX36dMZkjrph53lJY0Bnstzp3t5exDpIvUa31xs%2FCsl1UOK4zmGJA61hHL1z84mNCtgFCQeqA00EQAeWLg8PPwKDQCSJDiIGJ4dp22LsJTke22LsWWyFFIamZCGfC6BDn0erXwV2ZjSsowo60PjmU43mOpnvTHCACSwZIYL2%2Bf%2FtnQ9cU%2Be9%2F5%2BEQBJMA4iYAKFQKYhQQCyOZG62xZaU9deV1gZ7uytrh9zrfi%2B3Clx%2FW%2F0z8NbNbr1KrW1pt6DO9joXbBVSlYCtUhtyqXVKJWDVFmqqve2612D3rt1dt3t%2Bhi88PZ6TnJz8P0mevJ4XPnnOOc95zuecnOft9%2Fk%2BzxdA57ZvZNmOLONISCQSGuhYerpTkuOVCglM9WdriBCSScVKheSO2xeHDHS4KScnS3Gss%2BJw17pXjh6DdKyzovn7uTlZCkhxcXFJyoScLIV6rjwuLu5evfpYZwXe%2BcihH7z0XNnevXvZiyGxL9%2FPEgI6PgiIKQchNDg4KJQXPWlHOBQgoBMO1d2ck76QYISyzoI8RdeeRWBoAR9bAB36grPc7ywAHTwpyR3oAOtMz6QQOWeN8lHMPjzkcIy7tEWxCztNe901lW7csr7Vf3zqw67B4RinuxZBbdhOABPT6MoA6CzVzeYwusB6RQIEHee9EIkUCsn8mxV9psWMpFBIFFMLUods1hU35WRr5IvKSr%2Fu96euro6AjrufSRjLsSWSLAzopreJrWICOsK63%2BfPny8qKgJ%2FHT49N89XSSjtOsvvUTP66ZWGTJ7txIEq8fJ64EcMX10Oq2VlyHAoeI9naaivhdgafP5yGB42t6xj1LD1Z%2F%2Fa2tq69Wf%2FyiiHsA%2F0hsmkYsbcH7w1UKCTpJQoFV%2Bl2vvUM%2BmmB2vKDDULZr6qH6wpe7CmDH%2BtWJQMywEnxDutL6kpCbjD4PbRgZYLZ2Vkj5STrZGXly%2F6lt8fWCEJ38EgZYhFxyth8UOLEHrllVeE9YonrQmHAgR0wqE65znpiyYrEuO8%2BoVz7BxK1ikvTdrUmGvc7vTSpVssOJpH37TCUAXOzm3btkA4bvjKhgb6UeHNc49h0dsWAtDBC6Ph1Wt8yygVEtxnRBDo8KGcAIKOwzFOv7%2FByBPQ4a8qfmIRQmT5Y86uJoY2EtAR4s3u6%2BtTKpXQOUUo6%2FB%2FMXm1J8QoCOxfnssHe2wnrCbs0U8oeKADQTeX36MOFOjMy068Y0kqPIeRAjo8KSdQoPO1xYs8Phj%2B70BAh6eGdMp5%2BumnhfhyJ20KhwIEdMKhOo9z0gNEENaB11xzY8PatWsfCfRn7dq1gbIVwfQc7pdykECnvDQJjxgqFArfTDiMo2rvu%2BmVjjJw9I4I0OFPOQ31tTU1NX6PXH3rgQfuxys3ct93f7YS0OGjHj2UVUNDA4%2B3LNklVhQgoCPcO01Yh%2FF2gxVcGJ2x%2F1%2BTk5MFBTqwwM%2B%2FtRR07VnUtWfR%2FJsV7CV%2F2M7IwQCdB2vKAJ6QyBk2lWMdHSH46PCnnGyN3NLTHRDQeeSRR1y6jjEeXT%2B%2FEtDxKCChHOH2ZAJoGQEdAdwE902gs467xVo8vgLYO4TSX4d99myNPFMt8yHR32X%2B8w2uQVCgk5qSAO7AeA06mdQZnj0lOZ6elt9%2FFzYkNNTX2gb6gwQ6lv3llv3lwgcdryiHgI7LX2XkFmaqZfjnTGw57vuT2N1CQEfo9z76WGd6fQuRiG2o8FyC32eBywgKdJZoC24ty8vJyVl8az4Ecs%2FPm5efN48R1L25sYENOjhcq2JWXMDkmblNqSkJHi06Gzf96PxoH0fSfv3rwZhe7i3lBBZ0frPv12mpCb4ljgmDWRkyXKdLi05qyvRJ6WtaRi6s%2BNxyelhyQjlC78%2FC1D4COmES3pvThp51FIlxwUuw4MqTG%2Bc%2Fu7XQq1T%2FsCZg%2FTetokCBzhJtQeGC3HnzchhQwvgK4OLytQ6z31984Zm2trYXX3BGhuow7ty582mXUTuKC9VQCVh06BUGyhkZi5SakgDRQx2OcaAKbHCC88LQ1Qu%2FMkKUU8ZSzvD1%2FcuOqrurAw46PlAOROcI1NBVW1sbFuq6zAwjcuA7xxIScF2imc93Hsgwbr8FUvP3b5opdv4Ld4f%2BAMROPlMtw087oRxvepXY2peATmTcbzrrJCklgXqRuRzDSoh3jpUENSkUEsv%2Bcuw8e8yy95jFBKnP8tsXnt9q%2FOUvug%2Ft6bP8Fpcfs5gOvrrvuo4kQF8CAjoQCOxHP2pau3bt5pZ1HGndusavLS6DaBL4PuLgEt%2Bte%2FDxHzsr2bSxGSpZt66xsXHthvXNOLX85F86jDvZFh2sZ6AsOt9alga3qWuPc27REm3Bhx%2BOI4QkccwVqAF02p5qtZ972yXlfOC4%2Bu7pE3fcvgRAB4eG4JPBKrEz8%2FNUycnJc9Nme6yHfWxA1tG58847XA7C3rV0zisdZTDw5%2B5vXu4sbtARiUR7nimBw%2FHNdcadmBpPnPq7OJZBhz6WTSgnMnqyMLWSgE6YhPf%2BtHTWCeo8LHaX4H%2BJbaCf7rO5r72U%2FuLu6%2B3unflYLJYdO3a0t7cfOnTIYrHMFDv%2FPXjwYIDY5rpqAgU6S7QFOCgSI8bnkz8pc6aNJU9uLFmQdwNQpFTqOlyoSCy%2B4QbFD%2F%2Bp8MmflG3dkD%2F%2F5lkMk0BqSgIsLwT3Jag%2BOnCbAHQqFs8fGxsTi0Xs0E6Wnm6JRPSt6jt%2F9P8aN%2FykxWVa17ymsHD%2Bkq%2Ff2rZti6Wnu23blqd%2B8YTHtGljM5AEfgizMqYdvJbdsbi1tfWnP93MWKSR%2FZW9PnWwp5czls08%2BsZrOOz54ePWDW9vzL2YMffsXPW7Kpzyx%2FNxXv2uau7ZuXPPzs29mHHLhRL6sYePW9888gDcF8v%2B8pgFHUI53vchsXsEAZ1IuvcRyjoQkJyiKMw6UQw6CoWEznCQPz%2Fa9%2F5lx9m3e1s3Nqs9fZbovnb27d73Ltg%2FcFy1mrV7nimhJzQ1VBF60ElXSXNycsbGxtiUk62Rm82HEEIL5l93bZWVleXl5fQiqUwGoLO5Zd10R8VjfMfJeQjh8zrjUdOO2rA2d1Oj27QgTwEeOZiTcCYgFh136%2Bhwg07j6fXqD9Q8k0fQgcij%2BLpiIQPjevD%2FFWLLiaQ%2BLExtJaATJuF9PW3EsU5xodrhGIcYDpOTE%2FAWjk3QuTQ%2BvvXnP6d3%2FC7z3%2FjmNy6Nj8MAEJuZeIFOgJyRy0rm5uXOysudlZnunNWSk5PjchXghHhxTU3NLQU3fLt6Hr6i9evX5%2Bfn19TUrFmzBhdKZbLiW25uqK%2BdBh2RaENjLsNP68jBpg8cV8%2BdedPy2j58IEfm7Nu9585aP3BcPf3mD9lycYDOokULb%2FP7U37rQpdgERrQsZq1T26cjxCKKTcdQjm%2B9h6xexwBnci793TW4Rjjd%2Fn%2B5Sicngx13ahOYL4kJyePjY398Y9%2FTE5Onq5RJKL76ETT0JU7iw6Ay9Zf%2FBtHnw2bvrn0Nuzmwu65Yab3ncvuMBjuT4h3hs164P6a%2Fv4TkIe%2FgbltrFpycnI%2B%2FHCcfiJw50IIqdKk5aVJdNBZs2ZNTU1NXV1dTU0NvmSpTJaSHL9EW4BBZ88zJYxrPGN9%2FAPH1Uvj42%2F9xyA%2BkCNzaXwcPKC9Ah2ZVJyUlJSlSc29aU72jalKpRLyuTfN0ZZnPP%2Fz8m1Pb3nqmeefeub5bU9vef7n5dryjNyb5rDTvJwUl7%2BpkIHOvvbShHhx7Bh1COVEXo8lgBYT0BHATfC%2BCT6wztYN%2BVZzRZ%2BpfMeWAvhvLvsFrUqTpiTHJyklAU%2FZN87JvnEOVJsodw49CAp0qqsq2Gp4VbK5ZR346PABnfypj1qthpEd%2FDU%2FP1%2BtVnODTllJkkwqrrrrjgeX3w%2BB0A2G%2B%2Fv7T8ik4rKSJEgsRPGxQDFLMl1nsVImFRfMnzc2NgYnpf%2BFOdIL8hQZ6amYSOrq6tZMfeijV7NmyWGaukfQcQ7bvf0Oro0jg6GQP%2BjIpGK6FQQWLsK3u7oyzWrWHjjU8ZtDh39z6PCrh56zmrVLtbPxDnwyoQSdJKWEPrTHp3mMfaor0%2Fa1L7SadfvaF3oVgpdRj29ft26YbzXr%2Bkxf29R4M3cNhHK87yvIEU4FCOhE6nPQ19eXlZUFPZhHu86%2B9hKruQIn4%2FYi7hdKULc6TUfXg85br92N08nX7n7j1coTXXeeNOtxIWQ2NE7Hdfex33ZzWHJysv%2FXC6AjiRPlzZvFMFFYzdrzo310i8769euBA8rLy%2Bvq6uCrWq2GUR5u0NnXXpqtkYfeRwdPL%2BfQig4669evr6mpqaysrKurw5iSlamEerwCHYyDUA%2F%2BClzoLegwKCdbI0%2BUx9HnkQHo%2FLLjF0%2B3G59uN%2B7e81OBgw54O%2Fm8ms7UUpM6q1lnO3qn1ezMhJJ1ALDgvFazzri92N0DRjc5kzhWkdpvhandBHTCJHwgTsuTdaor51jNFYO99169evUjx8VTrz907Wt15Rx3L5RglwPo0P1Jvci7gRV%2FisViZ3wD3xJeTmZzy7pby%2FIQQk9unM8NOuVTHxjWefLJJ9esWVNeXl5TUwN%2Fa2pqIhR0VGnS5ORkzDSVlZVwdbhErVb7ADoATDVTn%2FVTH%2BCn9evXV1ZWqtVqr0CHTTnZGjlYp%2FBjD6DT83onzHWyHNsbEaDj88rpO7YUWs26C%2Bf%2B%2FerVq5dGDoFxBasR1MyU1LrfnVg182r6B6tZ59J4RqccEpM8EL1HbNWBrpBPJCswOjqq0%2Bmgm0%2BIF7t8K600ZFjNFfZ3tsOFjp550WquWGnIcLlzCArTVc4BMt%2BSP0DDcWxe7qylutneJiQS0UGnqDAXIdRnWswNOvn5%2BTCmU1dXh%2FPg0QLeu9ygs21zQaZatvz%2Bu%2BofNcC860e%2Fa7AN9C8sUr7SUQYpUEE9DTULoMIXflGUqZZVLJ7vcIy7XDYmLTUBIUQHHeyM7M6iA7zrzkcHD13B4WvWrAFsgq9gD1u%2Ffr1XoOOScsCiQ%2F%2FtxBrogE0FvwXBrhOC90C2Rr667karWTd65pdwdvs7bVazbvk90yth4jbA2CL8fg8cOICbSjJEAZ4KENDhKZRwd2OwDtuCDRadU68%2FNHbpLcflC4O991rNFS7%2F24TfLMLMBCmo57V50b%2Fd%2FfCbRx7F6cRr3z126Ds9B1ZYDqzoP%2FwILn%2FzyKMYYvY8U8IAncIFuWKxyCPo0F1zwCaBx2LgKzfowFzr22%2B%2FvaamBl79NTU1x48f58C4QG2C6eUctSWnpGD7DVhiAOBwoVQ2PXtr7dq1CCHGupGgLTgjY9BZs2ZNZWUl%2FF2%2Ffj1kKqc%2BMNLH06LjjnKyNfIkpUQs%2FmoJRAAdfKMh4%2B3vJZQ%2BOjB05bNFB1xkhgbWX7ly5eLIQatZ17Xn1tC8AcCic%2Br1f%2Fhw7OyHY2cHe79tNevKS5PoZ3e69M18ent7hfsiJi0TsAIEdAR8c3g3bXR09O6774a3gVgsYgfQ2bGlADvoWM0V4fXRob%2FFvMoHCXQUCgV9WcLe3t7Dhw%2Fv27fvV7%2F61e7du%2BmLFh6zOEcxILFBp2D%2BPJ6ggzt%2BlxmPoKNIjLv%2FvrtW%2FuODEAvp0e8aTp48IZE4F5vx83Pvvfdu3LixpKTEZT1egQ5QCN0TWa1W6yszkpSS4ltufvzHTUlKyU8fz8d64gwDdPLz86ESoEDGV54WHVhq0t0cbAgJmZIcD09jrIHOUu1s7CIDmerKNK9%2BmP7sbNxeTD87w0cH8BQhpFQqBwcHeb8RyY5EgesUIKBznRyR%2B2V0dLS2thb6J7FYxPjv3YI8RdPqnH3tJfvaS5pW5%2FjzYgrjsZEOOhfev%2FjTn21xCTf0wm8uve3C%2BxdhKR3c%2FeOMu3V0EuLF6SrZkxvnP7lxvm9DV2vWrPli5nPvvfcihAw1C%2BC8OASEy3V04JFgTC%2BHoSsYY8JXt35tAXZGztbIp2YCToMjvkAG6OBj3WU8WnRkUvHBgwfdUQ40HubJgzU01kAnWyNfqp29Y0th155b97UvDCXlZGvkU6%2Bmm%2BDUTatvwq%2BXrAyZMyje1KeoqGh0dDRyX86k5WFXgIBO2G9BIBuA4wuKxSL8P1T87oj0TOhBZ9euXQGx6IwMH7o0dv7Mf3Q3r109l%2FZRq1WQaGVzddrFJ984eOod21n7%2BQ2NuYzEATpLdbMBF3wDncHBwRnO%2BcJkMiGEHqwp4wk6m1vWMUCnsrISVtCBuVGAKevXFhQXqiGGFzfoXBz74M23%2Bt3BDb38wvsXL4594HLBwFc6ysDQdfRIF%2FfDD6M%2F4KkTg6DDLU7ot6arpDhUp06nC%2BQrktQVkwoQ0Im2245Zx%2BkDkRgX%2BpdU8M4YEaCz0pDJkZKT4vGoEN0BFr%2FW8VaOjMtYVwnxznV0IFiEb6BjsVgw6Dz11FNegY6lp7u8NKnhu1%2FTVy371j3%2Fx2XSVy3b8bNvVFdVtG3bsrllHRt09jxTsqExt%2BPFNQFZGfnJjfPTVc7Q1qo0qctYV4wHFfypE%2BLFJYU3NK3OYSSG4wjjWPZXho%2BO5djeo2%2B8htOmwf%2B77FzOjd1z5%2BxPzXh1Dk4Fx26G%2FOzfzJ5rSi09kbHsXM6Ks1%2FDB0IGx7qymrX72kv99NFhNz68JfTFcgjlRFv%2FFKbrIaATJuGDedpdu3bhbtLjEjvhfal5dXaBg05X16GurkOWnm6O1NV1yGw%2B1NzY4O7CN7es4zgcb7IPDzGilzvt%2FDgCFL793mRKSkrAqDM4OAjHKWZJ0lWydJVMeUO8JE40b55zZWRJnIiduroOKW%2BQeIxe%2Ftr%2B79BBZ%2Fk96tV1WZAeWZHJ3djrYl1NOTLjY11mgClhyWA%2BoJOtkaerpDBc4lw3WSkBFyjf%2Ft6mm80IbcH%2Bmq6Sufx5YnDZsWV66BCP67EzUQY6gJvwJNx9993BfE2SumNIAQI60XmzDxw4gLuNhHgxeyqWu442gOUpyfEyqVgicdEvsntKeom7JW0kcQHwt8Wy4AyHMzL%2FoatsjRxCl3MLGIzV%2BiF6ebpKqkqbTl7Zh7AO7IwkTpQoj8PpzJkz7c8%2Fg7%2FSM2bzoWueYc89%2FyyO0oVdZ3DmwsXzR1%2F9JwAd%2B%2FBQp2kvPe2e%2Bvx2%2F152ysqQYcrJ1sizMmQgdXVVBb0GRv7Xv97z61%2FvgUKeoAOVq9KmcYctiHclmDvdZ7hBZ3Vd1tYN%2BdxpdV0WBiPuZ0%2F4W%2BnTyFetWhWdr2ZyVeFQgIBOOFQPyTl7e3uLiqaXEhaLv1rxJQTvu%2Bn%2FlolE9PVpbi1NoneNHHl6eAFG3rueht%2Fe%2FoAOgAs0UiwW0Wcpu9Q5eKBDP11CvJgOjulzpTippj7uvqbPldIPpLt5TaHJS%2FSz0POWnu5r3tAvGndhrHGZ2f3i9%2B64ffFjP1yFmUyVJnVGI0eIPpBHr9llPoBMmZaaAJFJGP77AD0uFw3iU5iukvJJWRmy4kI1TnCx3oKLt%2Fu7lDTshXiCFUJo165dIXlHkpPEigIEdKL5TtOX2HE57TwYbzdYCK6sJOmVjmlXVmxv37FlAZxx64b8fe2l3qaXn3M97Zkfz7jdy2fQyUx3TgyhJ5lU3FBf63CMQ7IN9C%2FROucZdZr2QsnBgwcDHn8RLDoctxLr7zGDbxCjNm7KydbIAXTKSpK4T4FEooULFz7yyCNwMyDa69jUx%2BEYX2GogugWDPUYjQmU8QwA66vxPpGTU5OUEvbpglficIxTtE%2Fbti0rDFUURa1du5YNXu6aEQWggydYIYTIYjnR3CeF6doI6IRJ%2BFCddnR0dNWqVdCvsKedu3t1%2BlwOS5Lg6T%2Fsbm9TY262Rr6vvfS6Ta%2FdbqWl%2Fq5vvtm99C3zbfRC62u39%2Fz2m25pxY8NvoGO1azduiGfLVSHcSdFUfbhIfvwEGQsPd0URUHnTVHUb%2Fb9mn2UPyXBBh2PlOMV6Oh0t%2F5gzbRFZ9kdi0EZ0GpycqK5sYGiqMnJCayeS2X8t%2BiAS9NS3WzAccv%2B8me3Fi7VzUYi52idy5MGo3BycoKiqE7TS5CAciiKamtrixHQyVQ7Hcbh50umkYeqW4i58xDQiYlbHrKpWBCZnA4xU6G1vlorpc%2B0uLw0iQE6fb3deMk%2Bi8WyY8eO9vb2Q4cO0ad29%2Fb2wrJvfiCN60ODATrFhc5l7G0D%2FRRFNTc2gI9IcaEauvDAdplBBR0%2BlOMV6Cz5%2Bq3YF7u6qgL0ydbIAXHatm2xDfTT1XOplZ%2BgA0%2Fps1sL6Q8q5Dc05iJR6Ow68DyA2Q%2ButG3bltgBHTLBKia6HwFcJAEdAdyEkDThwIEDONq5TBos92SEUO196bj%2FcFy%2BcOXKFcflC3TcWWnIjBHQgYEJ6MDArkNR1D%2F%2F8%2Fdcdt4%2BFwYQdBg2Kp6UExDQ2dyyjqIoGL2CwT6KomwD%2FS5l8Qd0wOj4WEMOfkoZmW%2FdOdejr5XLVvlQCBYdiqKwu%2FQSbUGMgA7d9bi5uTkkb0FykhhVgIBODN34wcFBHAE0SC47CKENjbnQc9jfacPivnfuZdydbGrMjXrQwX4XuKtubmyA4ZjDhz0sXudtf%2BkRdFYaMo3bb%2BHjEbUgT4HPzp9y%2FAQdrNXk5AScvdO0l4Ny%2FPTRcfavIhF%2BGk%2BfqHdcvjB2yXr6RD0UQnAP7pWUsUp%2BZiYnJyYnJza3rMNGncW35lMU9dxzO%2FjXHIk%2BOnTXYxKnE78nSSZIChDQCZKwAq2WERWLPq2G%2F4vV3Z6wzg0GnTMnf4hVmIpLPD2ANRWM4jofnegbusL2myXaAktPt314qLqqAv6zbh8eciegb%2BXg%2FsyYXO3nV4djvNPkdo4Vu53YGdmyv5wjIZGIPXRlHx4C0xcMaQHl2IeHYACLfS4%2FQSdRHkd3msaP6IdjZzH9IJFIqQiFVzJjKFOVJq2pqQGvHZcX7rIwskCHvuoxiWCFHz%2BSCaoCBHSCKq9AK6e77ATW9VIiEZWVKKcCiGptR5e9d%2B5lx%2BULUyGRv3LTqa5Mi3qLTnGhuqG%2BFvxqwfsE2y1WrHjAZXflcyEOqgChFQLyF69GyLNVADr0GUzu8mzQaW5sKC5UOxzjk5MT4KGCtcI2HkYz%2FBm6kknFebmzgGlsR5fRf6IYdBQKSWimXzkc49jmBw4r%2BNqxJxPj2tlfIwh06OsBklWP6c8eyQdVAQGBzq4%2F7Nr1BxfLJ4x%2BPOpuU1Clie7K6asnT8WDlLJfoD6UJCklCoVkzzPFM8HSv%2BIb3IuwZ10ds5j6ersh9Vq6nnv233754o6uQ%2Ft7LV24vK%2B3%2B%2BCr%2B1y7E%2FtXGlhn5Oqqig7jTpBuhaEKuquG%2BlqYVvPA%2FTUBn17uw20K%2BCGWnm5VmpTPIsJ3Lfsa7sKLC9Vt27aA5QbyU2sATk9B6jS91LZti8um%2BgM6isQ4hUKCn8aLIwfhl37m5A9xIRKFKFTcCkMVDFoB5cik4hWGqob6Wq9AE45NVwXmJ%2BxS8IAUOn3AZz5k1ePo7l%2BEdnUCAp27v7gbUaj2z7UMjYr%2BWoQo5JKBGHuSr14p0Nvbi92T%2FZ95vlQ7u7pyTlaGTCJxrhP4SsdCl6wDsZEZFh3cwXBnLPvLZ96Tgfw3sKDD3SUEY8FA7jOGZqulp3uFoYpP2tyyDoOOz23zB3ScWCAS4QFWq1l76vWHbEeX4Wev9r50hJA%2Fi4kv0RbQE75M7IiDSyCjSpMmJyfn583DR0GMd7wbPpC%2BA%2ByzRCwHBzEAACAASURBVFtQtjAvJyenqMA50Y8jTf1C0%2BhuWBw7B3YTPRQ5Qqit7SvvPa9eWWRnooBvCggIdEY%2FHmUzjTv68e1qyVEMBeguOz4HAV2qnd1nKges6TOV37FktrMqheSxhuwZ3Jm26yy%2FZ%2Fpd3LQ6h3the5dbN6zNDSTgzNRFQMf%2FXg3bIcAawf2Xw%2FmGZ0v8AZ1sjTwhXqxQSNgLWlrNWvBE9icaLgxZ4hEoPPpmHx6anJzA08rwlTJGrOBAWI0J7DpQ4RJtAaxWAOOhKwxV4MyET4SHwHDN9Az%2Br0WfafHquiz6pmDn4QLh16ZUKsl6gIyXMPkaAgUEBDpXrlzp%2FbQXUUj5d2Xvp71Xrlxp%2B2MbolDRX4tCIEQsn4LusuPDzHOgnNMnvnfm5A%2Bs5oo%2BU%2FnNOYnTS53iKD8zVOHxX7x6mMc9A7VDiEFHEifyx1oQ7G7J%2F%2Fob6ms7jDs7jDtxp06fVeR%2F%2FX46I0PwTmBxxlI6T26cj0QiiUTkTyNhnnyHcWen6aUO406AFZhwhxkF1w8QoFbNhrUlsX8VrBwIx4KPF7i3W3q6N7esA38m4J5NG5vXrl37%2BI%2BbqqsqcLWMDAQHHez99tDA42C4WqqdzdgnSF%2BTlBL8OyXDVbHcy4T32oUFOleuXNn1h10ANwA9iEKjH4%2BGV6NYODsjMJYqje94f3XlHKu5Ymjgx6DSucEnrOaKlYYM6E7SUhNSkuMhlhDPv0qFxOlF4Sbhl2YAM76BzisdZUqlM6Y3I3F3GOA3Gq4wq9xtC8hWuj1jcnJiyjnJOVfcqzlcHlvip0Xnq0DlIpFCISkrSSorSXJ6TyPkvwcVgA4YWugKAPwB0MAFAuXIpOLiQjUspYPR0B3oNDc2gOPXCkMVgE7VXXcsXLiQHvSUrZ7VrB3s%2FTb8QmFmgLtYH%2Bxj%2FSmhzyEnw1Wx0I8I9hoFBzpXrlzZPLkZUQjSgc8OCFa7KGuYb8NYy%2B9RWc0V5wafADXs72y3miuCZBuH6esBRByoyjfQgTEORmP4LDQX3awDE8WrqypWGKocjnEYggk46MikYo9Se3SHysqQQUhRmdQZsEypkATE0gag43CMM0wveIzJ4RjP1sgx5WRr5AA6sMPmlnUQ8IuiKLpFB5MNmIVg8SQ4BCp0RyTlpc4AZKdefwh%2Boe%2B%2F1%2Bsueom7Gnwop8%2BuysrKGhwcjLK3JbmcyFJAiKAz%2BvGo7n90iEJtfyQ%2Ba6F%2BnOjDWHxmYy3IU1jNFbajlaNnXpxaFbDCaq4oL03y4eXo8ZDoAB08dBKVdh0I6QW3Ek%2BnCizoQDBOj%2BvceAQdj8%2BbbzsUF6rxtDu88iFQCw74SqccDDr24SEgG5egU11VgT2fYOjq5MkTFEV9t%2B5B7KrsrsHgoHNucMt7514e7P221azF3nLuDvGnfDpa6tR%2FAshwVajf4OR8rhQQIuhcuXKl9s%2B1iELEnOPqlgW9jDGM5XFRwZWGjJkJVk7KgXErf16U7o4VPujwn62D7TqqNGm6KnoSgA79iubnqSiK%2Bu3%2BvfRCn%2FPQifJxFg4X6IBFp9P0UnNjA0R4gDEmeKrtw0MffjjOGCMDiw59dA%2BigFl6upsbG%2BDwTtNLwIu42uPHj0OksObGhubGBg4fnerKNDynzGrWGrff4u4n5md5ukoqiZuO0ElmVwX9TU1OwFsBAjq8pYqlHUdHR2tra%2FG4jEcP5erKOavrsppW5wTJlgPv34gAHY%2BWBtyXAOtgkaMjMzb1gWvZvXt3TU1NcnIyRVG7d%2B8O1AXyoRyYWuW%2Fww2%2BWfwzxYVqQBMYV2pubAC7DtRgG%2BgfGxtjNAxAB9uBYE%2B8uDZFUR3GnYxqb7%2F99v5%2Bp0UHf7hnXS3IU8AvNHi2HLrfMRmuiqXuIgKulYBOBNykcDWRvqig%2Fwvt8O8q3O0ZEaDjVRCxTLXTTSSaEvTxZ86cGRsboyjqxReeMZsPXRthGRsbW%2FmPDwbkSt09HoxysVjEE4kYB%2Fr%2FtbhQDUsKwaBScaEaMqo0aU5OTsH8eexTuLTHgKsT9lCGau9cdkdOTk5qSgI%2BC5zL%2F0n77FbxLMlUy6ZnWU7BLBmuCtcbm5zXnQIEdNwpQ8qdCtCHsRBCgY0XwfM1incLHujs3LrI%2BtrtOL1lvu1k99KT3UvfMt%2BGC50Z81cLPbt0RgajhVesg68uOjJgeIBYlRCR2zbQD1%2BxA0oIrhRClKelJoTgXDxPwfDL4XkUYzeYxxSagKOMU7v7Svc7Rgjt2uVidXvyMiUKhFcB9JEgP%2BCj0%2Fn7TkG2LrYaNTIy0tTUhMcdJHEi%2FpPP3b0cF%2BQpfEjzb56FmxHYjELhjFzhVZqO5TTVDoVCUv%2Bwpv5hTd686RbGMuu4u%2BmhLAcDQyjPyH2uaKUcelQHnU43MjISWy9HcrURogABnQi5UeFuZmdnZ1FREeCFWOxvbOd97SV0%2F%2BWZ%2FFf2ErrtBOeDFAICloR2t3IPR%2Fn0MiEikdWsHRp4%2FNzgE5b95YR1uLv8EGyF%2B%2BI%2FjgeqqVFJOao0KX1tz7a2tnC%2Fosj5iQJuFRAo6HR81tE60Tpylfz%2FwO2dC%2F0GhmlHJhX7HEeQATr9R1bPpO%2F3H%2Fl%2B928eNu%2F%2Fzuvdq6YKnSWQDnc2BNaQg7nNty4NhtIea8gZGngcbof9ne2PNeQghCRxooR451ovwulufbvGiDuKUE4Ibhl9Ajkx5IT%2BVUzO6K0CAgUdby%2BD7B8yBRimHd%2F8PRmg09fb3TvzsVgsO3bsaG9vP3TokMVimSl2%2Fnvw4MFggE5ycjL29%2FSqkwDQqb0vHYPOucEnAHSyNfKsDBmsa0dYxytV%2FdmZUI4%2F6vE5luGRQww5IXvxkhP5owABHX%2FUi9FjGaYdH7x2ogN0YA5zukpmO7LM%2Fs72qVWhtekqZ%2Fx26DMI6%2FDpOwO1D6GcQCnpsp5MtRPc8f80iCEnRt%2F%2BkXnZBHQi874JoNWdNK8dmJDFfwX9qAEdWAsnXSV7rCHnsYacdJUMIUQ34RDWcdlrBrwQvGLpygf8FF5VGGV%2BOcSQI4A3LmmC7woQ0PFdO3Ikw7QjFot4TnyNGtCBoEV4ERGJRMT2WyKs4xUi%2BLazJE4U3rUP6M2OJsrJVMvoix0TQw557UeiAgR0IvGuCavNDNMOHyflaAId6OG4w0dj1hHUyi70vjnS88IBnWiiHLrTMYR0ENarh7SGKMBPAQI6%2FHQie3EqwDbtJCklHH0nA3Te6Pn5Gz07IL1%2B9Ok9v%2FqXfXvWH%2B166vWjT%2BPyN3qe6T7wM%2BwiEMCMz87IHBfI3gSsA0GOkpSS1JQEkrxSgC0pvUQgoBM1lKNKuy5qlV6vt9lsnO8AspEoIFwFhAs6ZG65cJ8aNy2z2Wx6vR4jSEK82J3PBAN0ZtbRccYE5UhBWkcnNKAD87BUaVI8zoWFIhmPCkjipv276XBDzwsBdKKGcuiGnKysrI6ODje%2FeFJMFIgMBQQKOjaHTXdJFxkSklZerwBjJCtRHsd2W6munLP8HpW3SX%2F7HI89og87hAx06B1zVoaMJJ4KJMrjhA860UE5DKfjpqam63%2Fc5BtRICIVECjo6M%2Fq0WfIcskSkaLGfKO9HcmiEwA7X16a1LQ6Z1Nj7jcqUnzgGI%2BHhAV02JfJLll%2Bj3rrhvym1TlLtbPZW4VcEtiWs0FnqXZ2eWkSXQFs0YGnZeuGfN%2FCdC%2B%2FR72pMXdTY65XmkcB5aSlJtCdjslYVcy%2FxaNKACGCju09G5pA6H%2BR7j1i1Ingp40xksV%2FTha9A1tpyMCDWZb9t3qkFh92ECboGLffgmNf9JkW%2B9Zt05UMWT7gLcegU16atHVDPl0W4%2FZbgEgAdKor0%2FBWq1m7Y8sCr66aUTlPzSOdchixx8lYVQS%2Fc0nT3SggRNDR%2F06PvkSIQuhjZLlIjDpubl2EFDNGsvjMyaJ3TkA577370gX7q%2BffaTkYhM%2BZM2eqqyroJw17fqUh02rWDvbee%2Bm8ZfTMi1azts%2B0OOyt4tOA5feorWat7eiyALYcQIcBMRho%2BkyLqyvTAHSg8L13X75gf3Ww916rWcsTVrI18qXa2bjl7737Mk%2FNI51y6O441%2F6T0NraGiHvFdJMooAXCggOdGwjNvThFOVQCH2BdAPEqOPF7RTmroyRLJh5xHbcYfej1ZVzrOaKc4NPwHWNnHnBaq5Yachg7%2BmyZMeWBVaz9oOLb8Hhp15%2FyGrWMoY8XB4Y9sJNjbn0lp8%2BXh%2Fsljc3NnSa9kJqqK%2FFCnQYd2IK7DDuxPt0GHcu0Rbgr52mvW3btqwwVL090PmJ47U%2Ffjb85z%2F%2F%2BbPPPrs63vuJ47XD5n%2FvNO2FOBuMCpdoC%2FC53GUAdDDZsDN9psXKG5yz%2FKxm7ekT9XC7L9hftZq1Wzfku6uWUQ6av%2Ffuy3D40MDj11izujKNsRv9a0RTTpJSQjd%2FkrEquO%2Fkb1QqIDjQ0Z%2FUo%2F%2BeAZ0vERpBlmFi1ImGZ489kqVUcE1Bz9bIAXROn%2FgeXP%2BQ9cdegc5M1%2FUSHD5ocf4Xf0Gegt5XCTMPLR8982LIWj45OUHNfCYnJ4B1bAP9FEVNTk6sMFRVV1XMbJ%2F%2Bt8O4k1EC%2B%2BPCL774AuehnubGBoqiOow7szXyFYYqiqLoUOXuXoA%2FO51vTr3%2BEGArLgRutpq1p15%2FCEQ7%2F%2B5LVrO2aXWOu2oZ5avrsqxmrf2d7XA41M%2FhqRO5lMNwx8nKyurs7ISrJn%2BJAlGpgLBAxzZsQ8NoetyKcrrpoN8jXS8x6kTPs8cYyRKLRSnJ8YwuB39dkKeAieinj3%2Fv9PHvwTAW3uoxA4MdtiPLzrz5Q6Ac%2Fv%2B%2F91h5UHfALT99vB5avq%2B9NKhnnJycsA8POeFyCmgsPd1ALZh1wK4DpEKPgdpp2ktRVHGhOlsjtw30f%2FnX%2F3IOAB1ZBi2nKOrSezZ6tUA8DfW1gFb0qtxd4BToyDDTXLS%2FCr8HsNlAebpKliiPA%2Feg08frwQbmlRmsvDQJqsKad%2B1Z5K5JEUo5jGWOyRqA0fNiJVfCqYCwQEffp0f%2FidDfZyw6FEL%2FhdApZHmXGHU4b2OkbWTgjkzqdsWdpdrZeNGdrj1lHP%2FDdtkngbMLdGDeuqa6rJBPIfbuFItF3vok4fqX36PuMy2Glhu334LLg5SZnJyYnJywDfQ7HOMURXWaXgJjjG2gH4ikubEhWyP3CDqTkxNXHW9f%2FWA%2FtJyiKNtAf7ZGXlyohmob6muxmQfq9HhFDNChP%2BxwFqvZGUs1UR63IE9Bd4XmHnhin3f5PequPYugzq49i9wZ%2FyKRcjLVMoY7Dpk6Tn%2BQSD66FRAQ6IxcGtH%2FTq%2F%2FTJ81keX0RKYQ%2BhvSfaLTj%2BtbB4iLXLQ9hyMjIx0dHUVFRdhRgBt3fPatWZCnWKqd7a7TYvd2fpZkqp1xPRUKSf3DmvqHNXnzZonFLgJg8TlLKFtOH7qiKAqABhMJlPABHThk6OxboDnYbzA%2FAdkA67Rt28JHhGyNXJEYp1BIMNNgp6uPPvoIFyoUEkViHFS4VDvbWyDGLfGoecRRDhtx9Hp9tL1NyPUQBTgVEBDo4HbWnqudBp0JZBsh645jYaIwMzIy0traqlQq%2BeAO7o2EnJFJxdArDw08bn9nu2V%2Fed68WTKpWMhtztbI8dAVmF5gxAqcaWAwi79Fh36ldFSy9HTDJnqF9J3d5VNTEpBItOeZEsCaU68%2F9MHFtz64%2BNapY07vcqtZ%2B0pHGRJxjYG6q9nb8siiHJeIQyI5ROFrlFySJwUI6HhSiGwPvgIup2W5Cx%2FhbecU4v0RQo815AwNPA6y2d%2FZ%2FlhDDkIoxM3w9nQwdGUfHgLTzuaWddhrmM4lfIau7MNDkGD8yzbQX1yohhExcD2mV8innVkZTiPZUp1z%2BrfLtFQ3OwQKRxDlEMQJ%2FkuLnCGSFCCgE0l3K7rbOjIysmrVKmza4T8LnU9nGZp9oEuuvS8dg865wSciAnQsPd0OxzikDuPO4kK1fXgIPIUhD87IKwxV9uEh%2Bpzw5sYG8MLJ1sjbtm3BlTgc4x3GnbaBfjALQSUAOvQKed4XMOo81pDDBp0NjbkhMOdECuWwEScrK4tYcaL7zUmuzqMCBHQ8SkR2CKkCNputtrY2cnEnIV6crpLZjiw7N%2FiE%2FZ3t4CebEC%2F0oSuewBHG3RLlcUgkKitJenZroWV%2FuWV%2F%2BbNbC8tKkpBIlCif9s4JUvMignJcIk5bW1tIf73kZEQBQSpAQEeQtyXmG9XZ2UkPhB5B1p10lRQhlK6SPdaQ81hDTrrKOezCZ3XEIHXSAak2Uy3zLTHOnpXhYz2Zalm2Ru606yCERKKvEkIcyxMwzu7bV%2BFTDkGcmH9fEgE8KEBAx4NAZHMYFbBYLGzrTlpqgm89VsiOUqVJE%2BLFYJSSSHycchWQ1q6uy4IQlV79Zc9QY%2BIFHTU48ggBoOBrcc5w5tjf%2FSaZVJyWmsBYzBcUTkmOT0tNCFICtPLTl1wmdT4MqSmBf24J4oTx7UROHUEKENCJoJsVo0295mHA8N2RxIViig3unn3LZGU4jRDhTYdmVoVhu7ZwlLgEndr70p%2FdWsg%2FOT2TRCI26CgUEv6VwJ4KxXXBCoBvQvZXmJSTlpoA%2FIR10Ol0FgtZbyxGX5LksrkVIKDDrQ%2FZKhQF2DOzxGKRUiGJ9FGhoJJQAEFnw1T4LQ48Ymx6dmuhS9BJV321xjHjEHdfX%2Bko823gLCBH%2BXODgmHLYQRwQAiRMFVCeUmRdghVAeQQ3sfwroG%2Bjo7wGkhaFDYF7HZ7U1MTfd0df1Yf9qcPi4hjMehcGH7VY4JYEy7DgSGEAHSGrD%2F2WM%2FI716wmrUeQcdjPReGX7UdWQb0ExFqMxoZWMrJypCxR%2B4AccL2ayQnJgpEiAIEdCLkRpFm0hSw2%2B2tra30VZXBWzkYbhCM3ks4Xxvqaxvqa2HW9xJtAf0rbiQGHZp4brN4%2FT2XQ1cAOiO%2Fe8Ht8TMbLgw7w4Zzg47tyLKZ3bn%2BjVzQCSDlsB1xsBWHSzuyjShAFJhRgIDOjBLk30hTwG63m0wmBu5EhPsOBhGfM23btsCiw5OTE7D%2BHv5KD5NJQMdnhf05MFCUk5aagL3asS9OU1NTpP1SSXuJAmFWgIBOmG8AOb3%2FCphMJoPBgHsChFDUu%2B8UF6otPd0URS3RFkC4hs0t6yCGFAQhh36agI4%2FvOLbsQGhnJTkeEmciP5IazSa7du3%2B%2F9jITUQBWJQAQI6MXjTo%2FOSwX2HYeCRScUpyfFCmADlW6%2FJcVSnaS9FURAYHJYqXmGowtHC4UACOhwCBmOTn5SjSpMyYoyTUarofFuRqwqtAgR0Qqs3OVuQFXA5nhUkh%2BUFeYqtG%2FL7TIv3tZeursvytuOsrkzb117aZ1ps3H5LdWWat4e%2FPdB5zaLTZ1q8dUN%2BeWkSUA5FUeC1A7UR0PFWVX%2F295lyMtVOR2OxmGnCaW1tDfLPhVRPFIgJBQjoxMRtjsGLhNV36POzEEKSOFGSUsJY3MXnvq3PtJg%2BI3pTYy7%2Fqqor0%2BjH9pkWL9XO5nN4caF6c8u6HVsWfOJ4jaIoqOSw6VHw0aFTTrZGTkCHj6QB2cc3ymEvhwMmHJPJFIO%2FWXLJRIEgKUBAJ0jCkmoFoQCHgcfPFZY3Ta0rc%2BbNHzocjg8unLSatX2mxfy7TECQS6M9DocDpikZt9%2FC53CIKz752Wkgmw%2FH37v47rOQt%2FR0dxh3QuBMqIqADh9J%2Fd%2FHW8pxOZFKqVQ2NTXZ7XZB%2FHJII4gCUaQAAZ0oupnkUtwrYDKZGMsr%2B%2BmzvGPLAqtZC6TicDhOH6%2B3mrXlpUk8e02wxEB7Pxx%2Fz2rWdu1ZxOdY7IZMUdSnn37qcDg%2B%2F%2FxzAB2MO7geAjpYiuBl%2BFNOVoaM7WWMENLpdMTR2P1vl2whCvirAAEdfxUkx0eQAmDg0el09PksCKGEeHGS0rtFlptW51jN2iHrjx0Ox9j7vwNw4d%2Bb7msvtZq1F4ZfdTgcsMIeT4tOtkZeXpo02HPnoOXeDy6cdDgcZ996bLDnzkcfnl9cqC4uVNPbQECHrkYw8nwoJytDlprCjNiAENJoNMQLJ4LeHqSpkasAAZ3IvXek5b4rYLfbjUYjY4oWduLhE1ZiQZ6i6%2FpIUk2rc%2Fh3pQwfHatZy9NHB06xdUM%2B3cXHnTWIgA7%2FO%2BLDntyUA%2FYb2IcO1hqNpqmpyWaz%2Bf74kiOJAkQBbxQgoOONWmTfqFPA5aR0nsRTXpq0dUN%2B155F%2B9pLVxoyve0p8ayrfe2l%2FMe84CwL8hRNq3O69izqMy3esWWBu1MT0HGnjP%2Fl7igH%2BIa90B9CyGAwWCyWqPsNkQsiCghdAQI6Qr9DpH2hUcBisTQ1NV0bTaD%2F5xv8eLwd1fK%2FEw1UDRh0hk9t95j4xLo6fbzeYz1n3vwBnxAQHusZPrVdmCEgMtUyWM2PHnKEg2%2F0er3RaAzNY0zOQhQgCrAVIKDD1oSUxLQC4LbskniUCokqTRooCglBPRh06ONcHvMcsa48Hot34I51hXfjk3ly4%2Fy01AQhpCSlBA9FJSkl2Ro5LIHj0n5TVFREXIxj%2BlVCLl4wChDQEcytIA0RmAImk6mpqYntxwPLD6Ykx%2FNx5QkBzXCcIoCgU3tf%2BobGXP6p9r50JBIxlixSJMalq2T8K4E9FQoJw8wmhK%2BM9f1wk4j9RmC%2FY9IcooCDgA55CIgCHhSw2WzsYOnQsYnFokR5XFpqAqNH54CPUG5aacj0IbFbiHtxbzMMWdjxDXhWmCiPy1TLwpXSUhO426nRaFatWkX8bzz8kMhmokCYFCCgEybhyWkjUAGYq6XX6112ez7MUWcjRSyXQMQuQSmQqXaufONyZAohVFRURJb4i8DfMWlyzClAQCfmbjm5YP8VgPV4Vq1axXblAf9lCCYq%2FLEt%2FlRRXVVRXVURPBZZoi1gRCTl37bA7pmVIUtLTVAqmMGnMN2SwSn%2Ff0GkBqJAKBUgoBNKtcm5olABi8ViNBoNBgMH9IAXM2McJ7Ddc1Brsw8PwbLLk5MTKwxVwTgXBCW1Dw8Fo3KPdaarpCnJ8djRGDMNzoDxhoSgisIfMLmkGFCAgE4M3GRyiaFSgBt6YAnmRHlcRDgyYzjoMO6kKKrDuHM6zNbkRLZGvkRbsMJQtcJQBWsxw9dsjRxHFa2uqgAkwiW4QpeZEINOVoZMlSZVKiTuhqXwyBSBm1D9esh5iALBUoCATrCUJfXGuAIAPTqdzqWlB49wJSmdU9ZDYOyBABHsvy6xg17YadpLURSUwABWdVUFjq41OTkBo04URTkc4xRFWXq68Q5Q0ml6iV4hPY%2Fb01BfS1GUfXgIl9B3C0gezDaJ8jh3E6YI3MT4b5ZcfrQqQEAnWu8suS4BKeAReoB7EuLFSoUkNSUh4M49mEvYmcnJCW6jCx10ADhgJGtzyzqw8Vh6uimKmpycwH%2FBCEQvcTngBVYcdpOgxDbQ7w%2FfZKqdrjaw8g2s74fHoRgZMiwloJ8KaQpRIAgKENAJgqikSqKAewXAkbm1tZXD2AM9MSzYA%2Bjjj8mnuFBtG%2Bh3xxNgkuFACjroLNEWVFdVOBzjDsc4HAIexPgvQE%2Bn6SWKouAvlPgAOpaebo5WMTbBUFSSUpIoj%2BPGGmy2ueZZZbfb3d8osoUoQBSIEgUI6Hh9Iz%2B22f6m0fxdqfzUZGIf%2FBedjkJosqmJvYmUEAXYCnjFPQnx4kR5HKBPaAa8sjVyto%2BOfXhocnICW3SAouCvV6BDhxX%2BPjpZGbJ0lRSsNYrEOA4PYuBFpVKJbTaEbNhPICkhCkS9AkIFnbF0dPxWNJRuGxFijN9PTSYKob8rlR9fH4L4v1atohD6i04X9c8NucAgKYC559ocZnfOPYyRF7FYFFQAYhiEVhiqwKgDJqLJyYniQjW239BtOZiQKIriHh3L1sjZoMMGGo%2BmGkI2QXosSbVEgYhWQHCgYzK9r1S%2Bg9DbkPT6d%2B32yyGQ%2BH2LpVepPMbbEvOZ0Ugh9NeiItw2oJ%2B%2FaTS4hGSIAv4rYLfbLRbL9u3br62963G0i85AAEAyqdMIpEictgOlpSao0qTpKqf7c1aGjG5T4cgXF6rBDRnmWMGsKyiBo4BjXP6FYxmVA8SAYSY1xelJU333MoqihobOckyDol8dnWkMBkNTU5PJZLJd%2Fx8P%2F8UnNRAFiAJRoICwQMdkeh8jDs7odEMhEPqKxfIZQu8jdEKpPMkPdyabmiiEPtfrHQ7Hf1osFEIUQlfIqH8I7lZsn8Jut9tsNqPR2NraajAYvKIfNiuIxSJJ3LRNKFEeB1SkSJxmI6VColRIkpROF2lIjOCaUJiSHJ%2BkdO6WpHTur1RIoAaoUCYVy6RiSZyIY7rTwoULr83t2r17N7uFuKSoqEiv118LMm80Gkm8hdj%2BEZCrJwp4oQC6LKSPRnMa8w0901T0xFmdLqhpvKjo7wj9FaE%2FI%2FQpQsNK5enGRm5tPhoe%2FlyvpxD6U33935VKCqFPTCbuQ8hWokDwFBgeHu7p6TEajdu2bWtpacEMxHMIDPNEuDI33nhj0dRHr9c3NjZu27bNNPUZGBgInmikZqIAUSDqFRAW6CB0aoZvuhA6jJANvtagp8BeErK%2F%2F4vQXxD6WKk8xYk7Hw0P%2F09REbTq90Zj1D8u5AIjVwGMQUajsWXqY5j66PV63dRHM%2FVRKpUBBB3l1AfwRafT6ac%2B9fX1jY2NLS0tBGUi93EiLScKRJACAgKdnh76uFX3FOW8CaBzO3ohZIhDP9GXCPVqNNwEA9Os%2Fq5UEnNOBD33pKkeFRie%2Bgx4%2FxkeHvZYOdmBKEAUIAqETAEBgc7ly5dnzDlvI%2FQfU2naJflf0T98glBQ06dTHjb%2Fi9DfEPoCoT8idF6jGdi2jftO%2FKm%2BHlySYRLWVWJj59aLbCUKEAWIAkQBokBoFRAW6LS0nKexzjTlIPT28PB4sGX5uKfnvxH6A0IfIvSmRvOmJ8S5fPnyJ1OTE6LAngAAAipJREFUzL%2FUaC5fvvz7qUlY%2F1NUFOx2kvqJAkQBogBRgChAFOCvgLBAZ3h43GA4dz3rnDKZLvG%2FHp%2F3dPT0jCDUo9FYeCDO5cuXP%2B7pgUGuj2YM9WDd%2BVyv97kN5ECiAFGAKEAUIAoQBQKrQChAR6f7y9S4EN375bo845JMpkuNjSMGw7mWlvOMTcH7OtLTc5Qf4ly%2BfPmj4WH2NKuPhofBX%2BdP9fXBayepmShAFCAKEAWIAkQB%2FgqEAnTq6%2F%2Bk13%2FOTkA%2FJtMn%2FJsrkD1hphXbSRlPwmJvEkjLSTOIAkQBogBRgCgQUwqEAnRcCqrXf44QVV%2F%2FJ5dbhVw40dj4F51uws208497ev6i032u1%2BMhLSFfC2kbUYAoQBQgChAFoluB8IDOtm1%2FQIgqKvprdItLro4oQBQgChAFiAJEgfAqEAbQGRi4AoNWAwNXw3vx5OxEAaIAUYAoQBQgCkS3AmEAHY3mS4Qoo%2FH30a0suTqiAFGAKEAUIAoQBcKuQKhBB1xzDIb%2FDvuVkwYQBYgCRAGiAFGAKBD1CoQUdEymT67ZcjSaL6NeVnKBRAGiAFGAKEAUIAoIQYHQgc7w8EfENUcIt5y0gShAFCAKEAWIArGjQOhAB5YNJK45sfNskSslChAFiAJEAaJA2BUIEejU1%2F8JIUqn%2B0vYL5g0gChAFCAKEAWIAkSB2FEgFKADrjngnaPRfMlOxMwTOw8cuVKiAFGAKEAUIAqEUoH%2FDw%2Bn9MgCh2JdAAAAAElFTkSuQmCC%3B%22%20vertex%3D%221%22%20parent%3D%221%22%3E%3CmxGeometry%20x%3D%22420%22%20y%3D%22-20%22%20width%3D%22665.69%22%20height%3D%22600%22%20as%3D%22geometry%22%2F%3E%3C%2FmxCell%3E%3C%2Froot%3E%3C%2FmxGraphModel%3E